# Altium project MU_MP_39_V1.PrjPcb (part 5 of 5)

## Sheet 20 WiFi_BT.SchDoc
size 420 x 297 mm; Address1: Address1; Address2: Address2; Address3: Address3; Address4: Address4; DocumentNumber: АБВГ.123456.001 Э3; SheetNumber: 20; SheetTotal: 23; Scale: 1:1; DocumentType: Схема электрическая принципиальная; FirstReferrence: АБВГ.123456.001
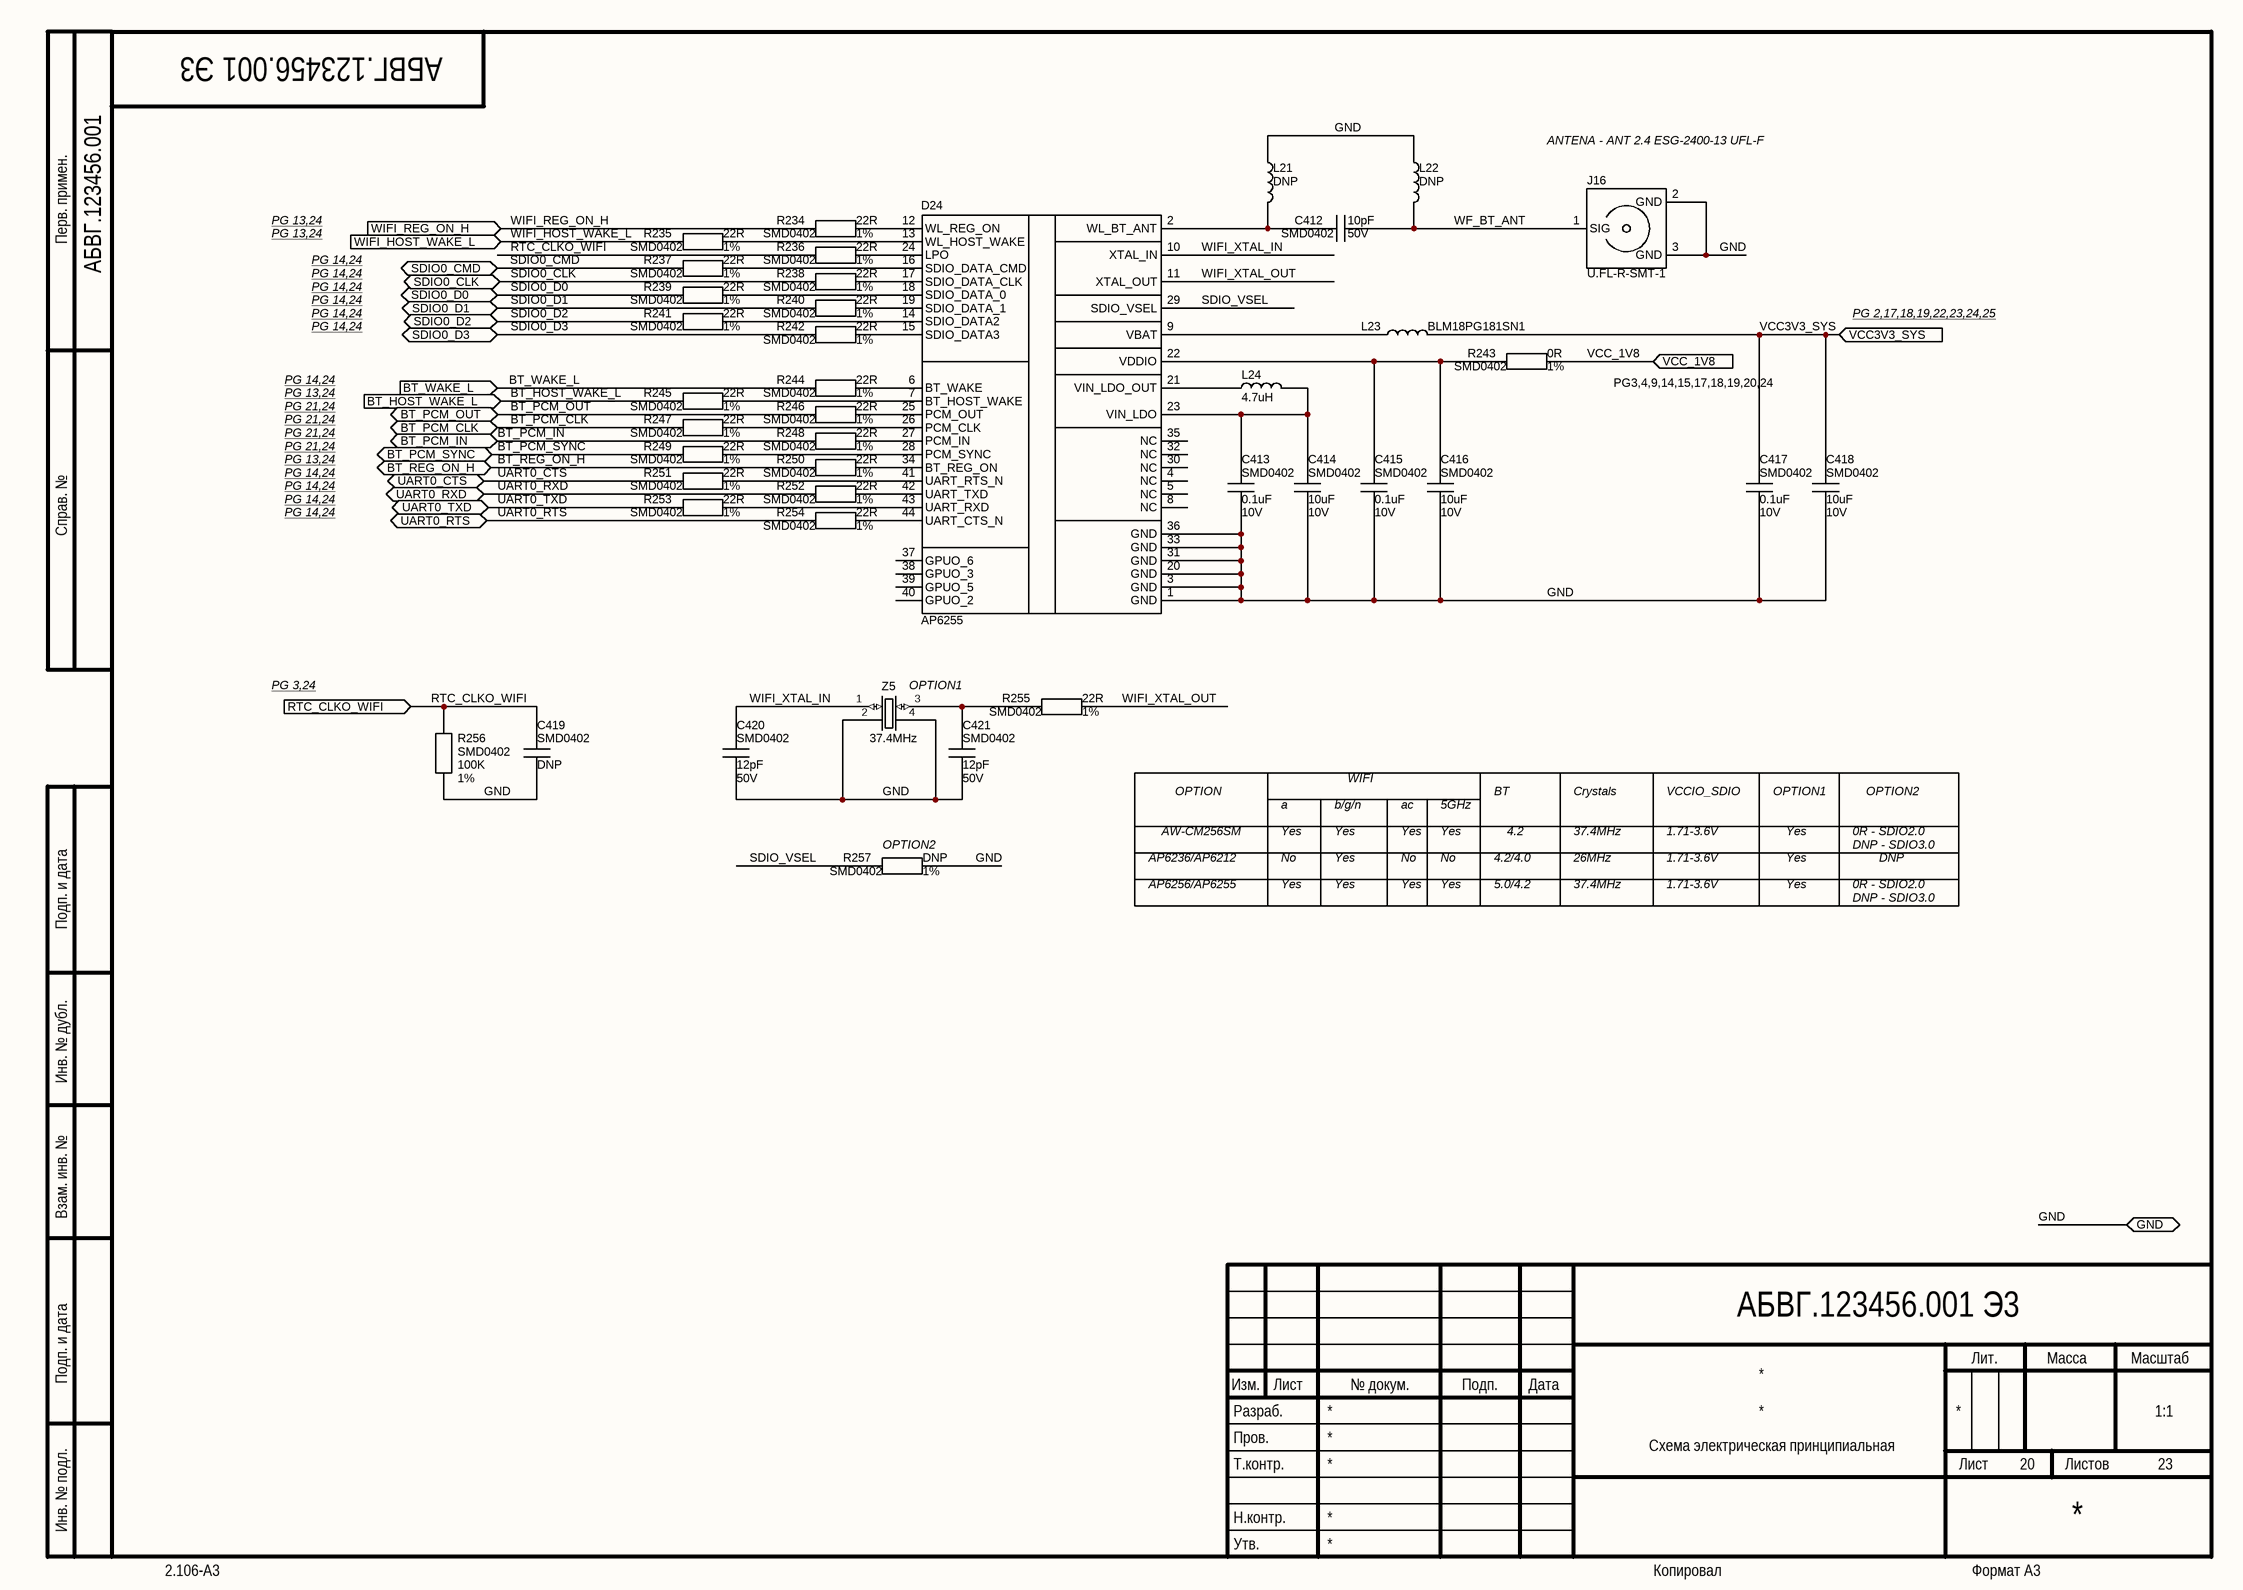
[diagram p19: 20 WiFi_BT.SchDoc]

### Parts
C412  Package: SMD0402  Voltage: 50V  [CAP_SMD_0402]  (hidden comment: 10pF)
C413  Package: SMD0402  Voltage: 10V  [CAP_SMD_0402]  (hidden comment: 0.1uF)
C414  Package: SMD0402  Voltage: 10V  [CAP_SMD_0402]  (hidden comment: 10uF)
C415  Package: SMD0402  Voltage: 10V  [CAP_SMD_0402]  (hidden comment: 0.1uF)
C416  Package: SMD0402  Voltage: 10V  [CAP_SMD_0402]  (hidden comment: 10uF)
C417  Package: SMD0402  Voltage: 10V  [CAP_SMD_0402]  (hidden comment: 0.1uF)
C418  Package: SMD0402  Voltage: 10V  [CAP_SMD_0402]  (hidden comment: 10uF)
C419  Package: SMD0402  [CAP_SMD_0402]  (hidden comment: DNP)
C420  Package: SMD0402  Voltage: 50V  [CAP_SMD_0402]  (hidden comment: 12pF)
C421  Package: SMD0402  Voltage: 50V  [CAP_SMD_0402]  (hidden comment: 12pF)
D24  AP6255  [AP6255]
J16  U.FL-R-SMT-1  [U.FL-R-SMT-1]
L21  value DNP  [IND_SMD_0402]  (hidden comment: Value)
L22  value DNP  [IND_SMD_0402]  (hidden comment: Value)
L23  value BLM18PG181SN1  [IND_SMD_0603]  (hidden comment: Value)
L24  value 4.7uH  [MWSA0402S]  (hidden comment: Value)
R234  Package: SMD0402  Tolerance: 1%  [RES_SMD_0402]  (hidden comment: 22R)
R235  Package: SMD0402  Tolerance: 1%  [RES_SMD_0402]  (hidden comment: 22R)
R236  Package: SMD0402  Tolerance: 1%  [RES_SMD_0402]  (hidden comment: 22R)
R237  Package: SMD0402  Tolerance: 1%  [RES_SMD_0402]  (hidden comment: 22R)
R238  Package: SMD0402  Tolerance: 1%  [RES_SMD_0402]  (hidden comment: 22R)
R239  Package: SMD0402  Tolerance: 1%  [RES_SMD_0402]  (hidden comment: 22R)
R240  Package: SMD0402  Tolerance: 1%  [RES_SMD_0402]  (hidden comment: 22R)
R241  Package: SMD0402  Tolerance: 1%  [RES_SMD_0402]  (hidden comment: 22R)
R242  Package: SMD0402  Tolerance: 1%  [RES_SMD_0402]  (hidden comment: 22R)
R243  Package: SMD0402  Tolerance: 1%  [RES_SMD_0402]  (hidden comment: 0R)
R244  Package: SMD0402  Tolerance: 1%  [RES_SMD_0402]  (hidden comment: 22R)
R245  Package: SMD0402  Tolerance: 1%  [RES_SMD_0402]  (hidden comment: 22R)
R246  Package: SMD0402  Tolerance: 1%  [RES_SMD_0402]  (hidden comment: 22R)
R247  Package: SMD0402  Tolerance: 1%  [RES_SMD_0402]  (hidden comment: 22R)
R248  Package: SMD0402  Tolerance: 1%  [RES_SMD_0402]  (hidden comment: 22R)
R249  Package: SMD0402  Tolerance: 1%  [RES_SMD_0402]  (hidden comment: 22R)
R250  Package: SMD0402  Tolerance: 1%  [RES_SMD_0402]  (hidden comment: 22R)
R251  Package: SMD0402  Tolerance: 1%  [RES_SMD_0402]  (hidden comment: 22R)
R252  Package: SMD0402  Tolerance: 1%  [RES_SMD_0402]  (hidden comment: 22R)
R253  Package: SMD0402  Tolerance: 1%  [RES_SMD_0402]  (hidden comment: 22R)
R254  Package: SMD0402  Tolerance: 1%  [RES_SMD_0402]  (hidden comment: 22R)
R255  Package: SMD0402  Tolerance: 1%  [RES_SMD_0402]  (hidden comment: 22R)
R256  Package: SMD0402  Tolerance: 1%  [RES_SMD_0402]  (hidden comment: 100K)
R257  Package: SMD0402  Tolerance: 1%  [RES_SMD_0402]  (hidden comment: DNP)
Z5  value 37.4MHz  [TSX3225]  (hidden comment: Value)

### Ports
BT_HOST_WAKE_L (in), BT_PCM_CLK (bidir), BT_PCM_IN (bidir), BT_PCM_OUT (bidir), BT_PCM_SYNC (bidir), BT_REG_ON_H (bidir), BT_WAKE_L (in), GND (bidir), RTC_CLKO_WIFI (in), SDIO0_CLK (bidir), SDIO0_CMD (bidir), SDIO0_D0 (bidir), SDIO0_D1 (bidir), SDIO0_D2 (bidir), SDIO0_D3 (bidir), UART0_CTS (bidir), UART0_RTS (bidir), UART0_RXD (bidir), UART0_TXD (bidir), VCC3V3_SYS (in), VCC_1V8 (in), WIFI_HOST_WAKE_L (in), WIFI_REG_ON_H (in)

### Nets
BT_HOST_WAKE_L: R245.1 ; port BT_HOST_WAKE_L
BT_PCM_CLK: R247.1 ; port BT_PCM_CLK
BT_PCM_IN: R248.1 ; port BT_PCM_IN
BT_PCM_OUT: R246.1 ; port BT_PCM_OUT
BT_PCM_SYNC: R249.1 ; port BT_PCM_SYNC
BT_REG_ON_H: R250.1 ; port BT_REG_ON_H
BT_WAKE_L: R244.1 ; port BT_WAKE_L
GND: C413.2 C414.2 C415.2 C416.2 C417.2 C418.2 C419.1 C420.2 C421.2 D24.1(GND) D24.3(GND) D24.20(GND) D24.31(GND) D24.33(GND) D24.36(GND) J16.2(GND) J16.3(GND) L21.2 L22.2 R256.1 R257.2 Z5.2(GND) Z5.4(GND) ; port GND
RTC_CLKO_WIFI: C419.2 R236.1 R256.2 ; port RTC_CLKO_WIFI
SDIO0_CLK: R238.1 ; port SDIO0_CLK
SDIO0_CMD: R237.1 ; port SDIO0_CMD
SDIO0_D0: R239.1 ; port SDIO0_D0
SDIO0_D1: R240.1 ; port SDIO0_D1
SDIO0_D2: R241.1 ; port SDIO0_D2
SDIO0_D3: R242.1 ; port SDIO0_D3
SDIO_VSEL: D24.29(SDIO_VSEL) R257.1
UART0_CTS: R251.1 ; port UART0_CTS
UART0_RTS: R254.1 ; port UART0_RTS
UART0_RXD: R252.1 ; port UART0_RXD
UART0_TXD: R253.1 ; port UART0_TXD
VCC3V3_SYS: C417.1 C418.1 L23.1 ; port VCC3V3_SYS
VCC_1V8: R243.2 ; port VCC_1V8
WF_BT_ANT: C412.2 J16.1(SIG) L22.1
WIFI_HOST_WAKE_L: R235.1 ; port WIFI_HOST_WAKE_L
WIFI_REG_ON_H: R234.1 ; port WIFI_REG_ON_H
WIFI_XTAL_IN: C420.1 D24.10(XTAL_IN) Z5.1(IN/OUT)
WIFI_XTAL_OUT: D24.11(XTAL_OUT) R255.2
NetC412_1: C412.1 D24.2(WL_BT_ANT) L21.1
NetC413_1: C413.1 C414.1 D24.23(VIN_LDO) L24.1
NetC415_1: C415.1 C416.1 D24.22(VDDIO) R243.1
NetC421_1: C421.1 R255.1 Z5.3(IN/OUT)
NetD24_6: D24.6(BT_WAKE) R244.2
NetD24_7: D24.7(BT_HOST_WAKE) R245.2
NetD24_9: D24.9(VBAT) L23.2
NetD24_12: D24.12(WL_REG_ON) R234.2
NetD24_13: D24.13(WL_HOST_WAKE) R235.2
NetD24_14: D24.14(SDIO_DATA2) R241.2
NetD24_15: D24.15(SDIO_DATA3) R242.2
NetD24_16: D24.16(SDIO_DATA_CMD) R237.2
NetD24_17: D24.17(SDIO_DATA_CLK) R238.2
NetD24_18: D24.18(SDIO_DATA_0) R239.2
NetD24_19: D24.19(SDIO_DATA_1) R240.2
NetD24_21: D24.21(VIN_LDO_OUT) L24.2
NetD24_24: D24.24(LPO) R236.2
NetD24_25: D24.25(PCM_OUT) R246.2
NetD24_26: D24.26(PCM_CLK) R247.2
NetD24_27: D24.27(PCM_IN) R248.2
NetD24_28: D24.28(PCM_SYNC) R249.2
NetD24_34: D24.34(BT_REG_ON) R250.2
NetD24_41: D24.41(UART_RTS_N) R251.2
NetD24_42: D24.42(UART_TXD) R252.2
NetD24_43: D24.43(UART_RXD) R253.2
NetD24_44: D24.44(UART_CTS_N) R254.2

Not connected (* = marked no-connect by the designer): D24 4(NC) 5(NC) 8(NC) 30(NC) 32(NC) 35(NC) 37(GPUO_6) 38(GPUO_3) 39(GPUO_5) 40(GPUO_2)

### Notes on the sheet
- (near J16) ANTENA - ANT 2.4 ESG-2400-13 UFL-F
- Перв. примен.
- PG 13,24
- PG 14,24
- PG 2,17,18,19,22,23,24,25
- PG 21,24
- PG3,4,9,14,15,17,18,19,20,24
- Справ. №
- PG 3,24
- (near Z5) OPTION1
- OPTION
- WIFI
- BT
- Crystals
- VCCIO_SDIO
- OPTION1
- OPTION2
- (near R257) OPTION2
- AP6236/AP6212
- AW-CM256SM
- a
- Yes
- No
- b/g/n
- ac
- 5GHz
- 4.2/4.0
- 4.2
- 37.4MHz
- 26MHz
- 1.71-3.6V
- 0R - SDIO2.0
- DNP - SDIO3.0
- DNP
- Подп. и дата
- AP6256/AP6255
- 5.0/4.2
- Инв. № дубл.
- Взам. инв. №
- Разраб.
- Изм.
- Лист
- № докум.
- Подп.
- Дата
- Лит.
- Масса
- Масштаб
- Пров.
- Т.контр.
- Листов
- Инв. № подл.
- Утв.
- Н.контр.
- 2.106-A3
- Копировал
- Формат А3

### Library data of the parts
C412 = Ceramic_Cap: PartNumber: CC0402CRNPO9BN100; ComponentType: SMD Ceramic Chip Capacitor; Manufacter: *; Tolerance: *; ClassName: *; Value: 10pF
C413 C415 C417 = Ceramic_Cap: PartNumber: CC0402KRX5R6BB104; ComponentType: SMD Ceramic Chip Capacitor; Manufacter: *; Tolerance: *; ClassName: *; Value: 0.1uF
C414 C416 C418 = Ceramic_Cap: PartNumber: CC0402MRX5R6BB106; ComponentType: SMD Ceramic Chip Capacitor; Manufacter: *; Tolerance: *; ClassName: *; Value: 10uF
C419 = Ceramic_Cap: PartNumber: Do Not Place; ComponentType: SMD Ceramic Chip Capacitor; Manufacter: *; Tolerance: *; ClassName: *; Value: DNP; Voltage: *
C420 C421 = Ceramic_Cap: PartNumber: CC0402JRNPO9BN120; ComponentType: SMD Ceramic Chip Capacitor; Manufacter: *; Tolerance: *; ClassName: *; Value: 12pF
J16 = UFL_CON: ComponentType: SMD Chip Resistor; Manufacter: *; Voltage: *; ClassName: *; Tolerance: *; PartNumber: U.FL-R-SMT-1; Package: U.FL-R-SMT-1; Value: U.FL-R-SMT-1
L21 L22 = Inductor_smal: PartNumber: Do Not Place; ComponentType: *; Manufacter: *; Package: SMD0402; ClassName: Solder_Clearence
L23 = Inductor_smal: ComponentType: *; Manufacter: *; Package: SMD0603; PartNumber: BLM18PG181SN1; ClassName: *
L24 = Inductor_smal: PartNumber: MWSA0402S-4R7MT; ComponentType: *; Manufacter: *; Package: MWSA0402S; ClassName: *
R234-R242 R244-R255 = Chip_Res: PartNumber: RC0402FR-0722RL; ComponentType: SMD Chip Resistor; Manufacter: *; Voltage: *; ClassName: *; Value: 22R
R243 = Chip_Res: PartNumber: RC0402FR-070RL; ComponentType: SMD Chip Resistor; Manufacter: *; Voltage: *; ClassName: *; Value: 0R
R256 = Chip_Res: PartNumber: RC0402FR-07100KL; ComponentType: SMD Chip Resistor; Manufacter: *; Voltage: *; ClassName: *; Value: 100K
R257 = Chip_Res: PartNumber: Do Not Place; ComponentType: SMD Chip Resistor; Manufacter: *; Voltage: *; ClassName: *; Value: DNP
Z5 = OSC3225: PartNumber: X3225374MOB4SI; ComponentType: *; Manufacter: *; Package: TSX3225
D24 = AP6255: ComponentType: SMD Chip Resistor; Manufacter: *; Voltage: *; ClassName: *; Tolerance: *; PartNumber: AP6255; Package: AP6255; Value: AP6255

## Sheet 21 CAN.SchDoc
size 420 x 297 mm; Address1: Address1; Address2: Address2; Address3: Address3; Address4: Address4; DocumentNumber: АБВГ.123456.001 Э3; SheetNumber: 21; SheetTotal: 23; Scale: 1:1; DocumentType: Схема электрическая принципиальная; FirstReferrence: АБВГ.123456.001
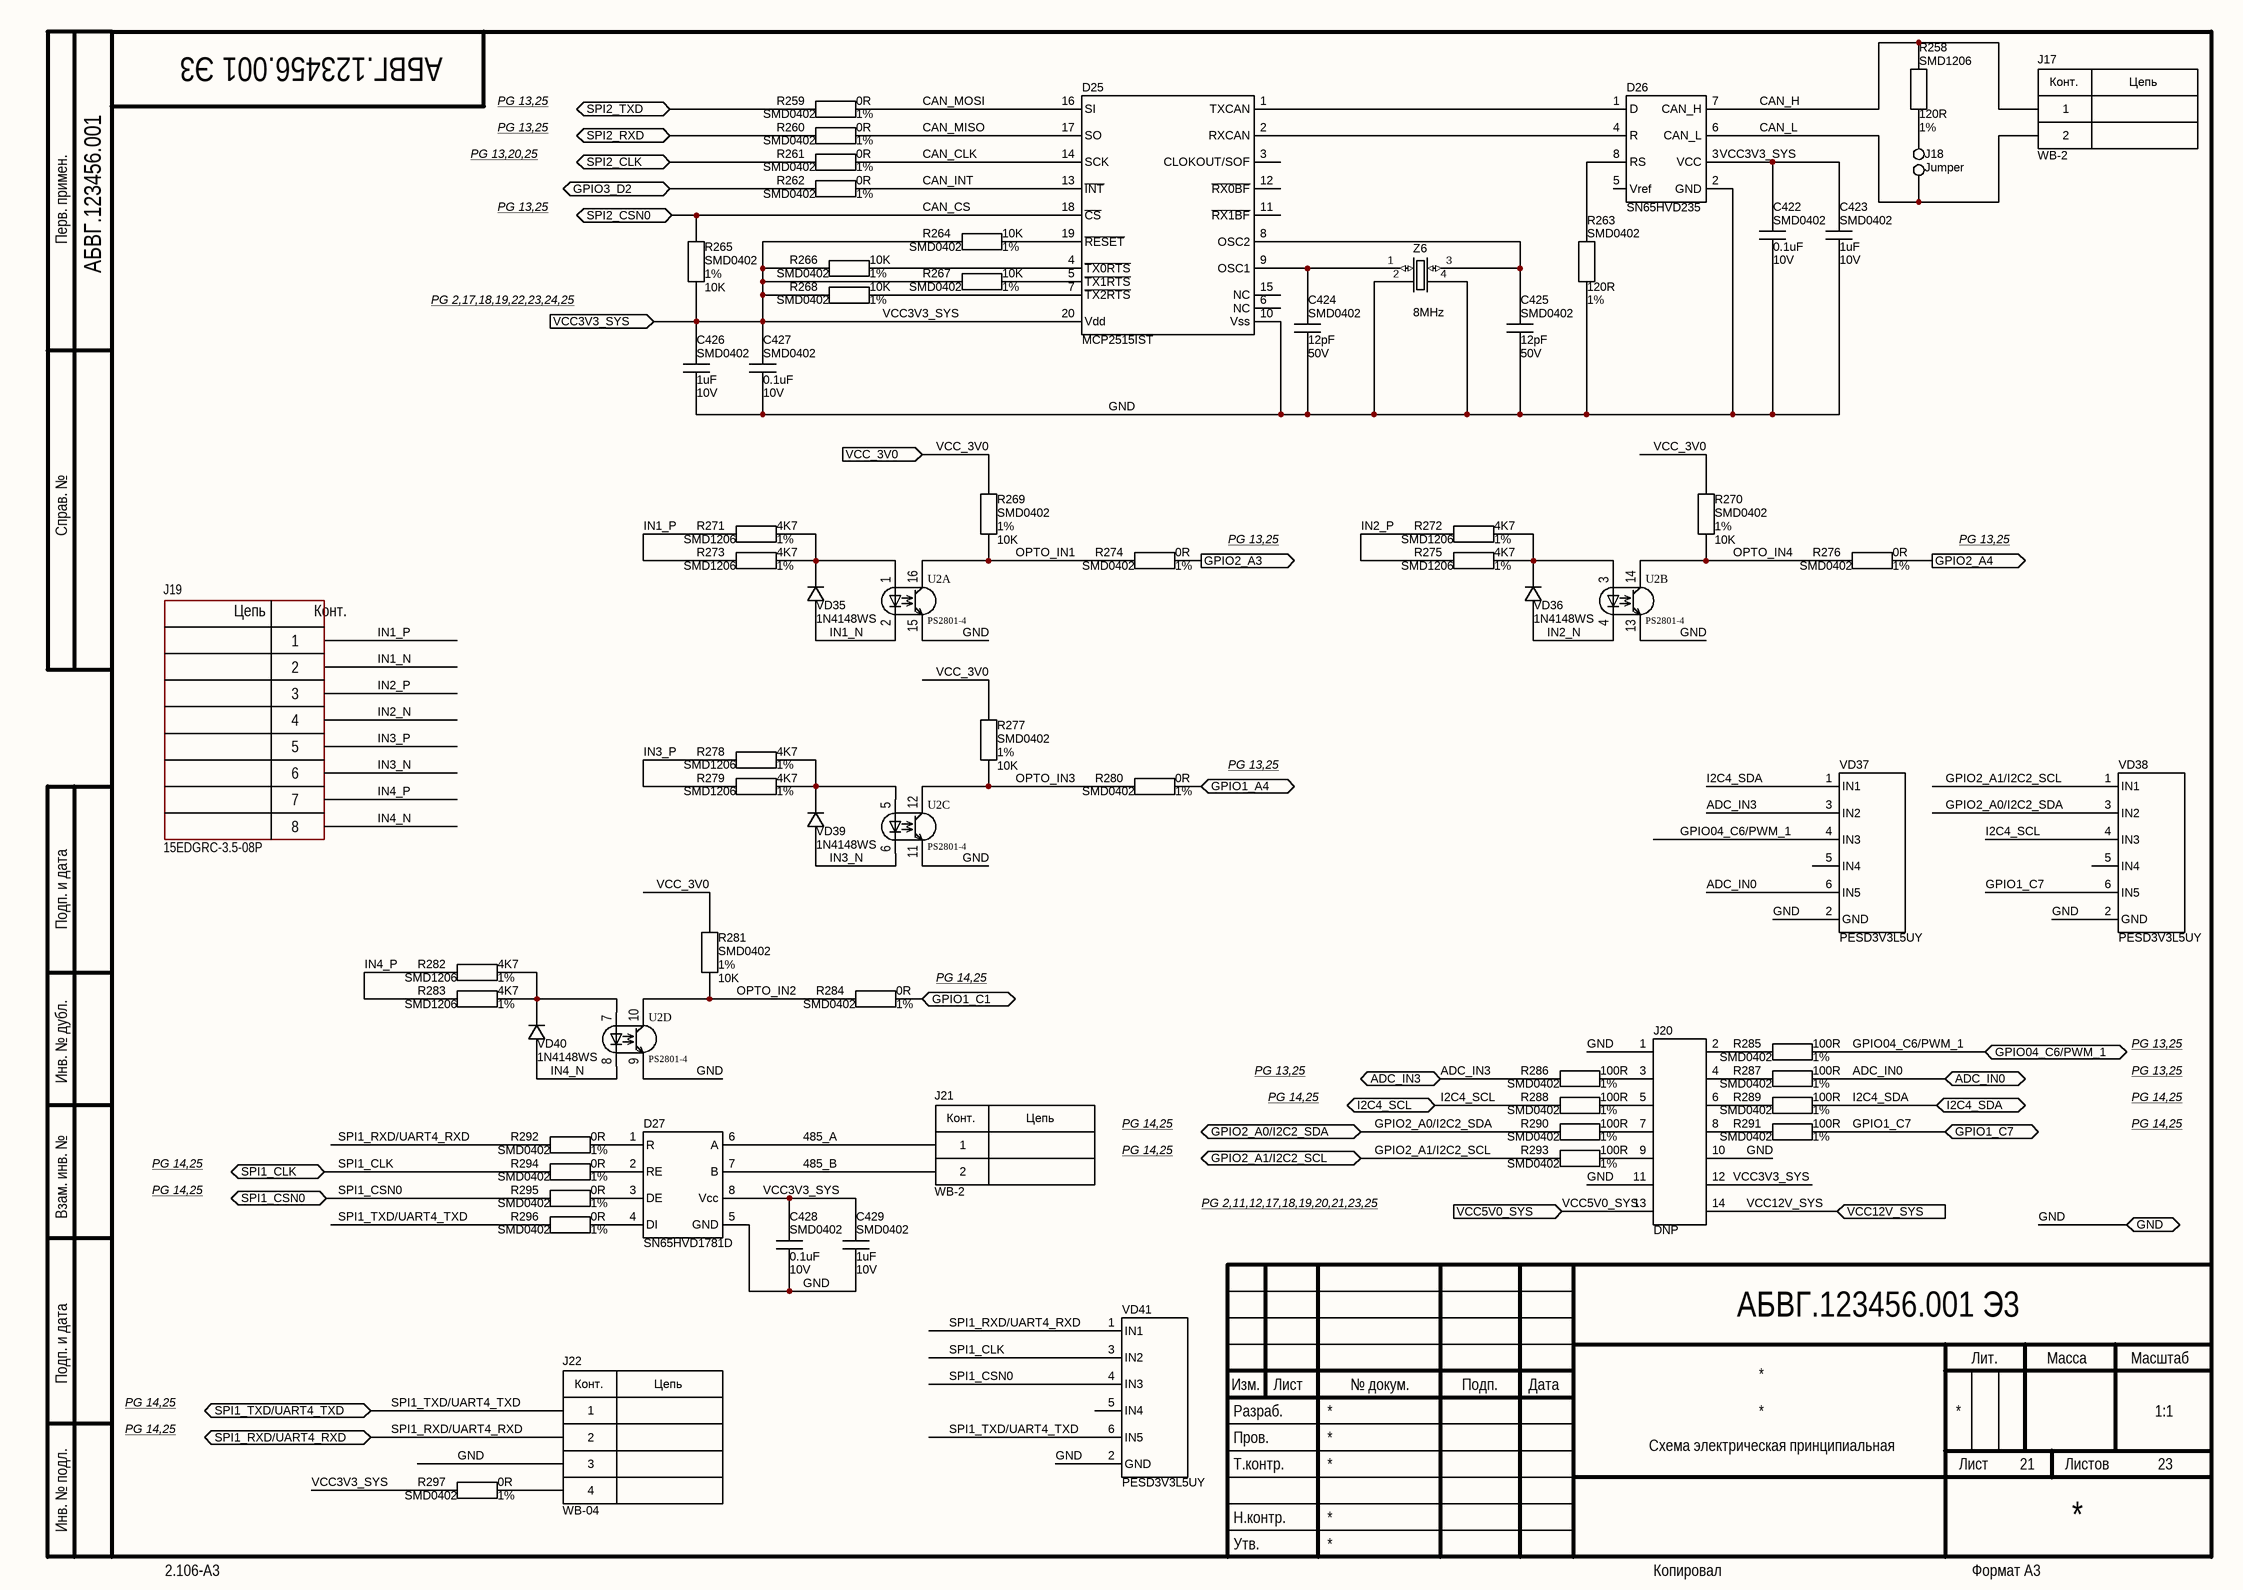
[diagram p20: 21 CAN.SchDoc]

### Parts
C422  Package: SMD0402  Voltage: 10V  [CAP_SMD_0402]  (hidden comment: 0.1uF)
C423  Package: SMD0402  Voltage: 10V  [CAP_SMD_0402]  (hidden comment: 1uF)
C424  Package: SMD0402  Voltage: 50V  [CAP_SMD_0402]  (hidden comment: 12pF)
C425  Package: SMD0402  Voltage: 50V  [CAP_SMD_0402]  (hidden comment: 12pF)
C426  Package: SMD0402  Voltage: 10V  [CAP_SMD_0402]  (hidden comment: 1uF)
C427  Package: SMD0402  Voltage: 10V  [CAP_SMD_0402]  (hidden comment: 0.1uF)
C428  Package: SMD0402  Voltage: 10V  [CAP_SMD_0402]  (hidden comment: 0.1uF)
C429  Package: SMD0402  Voltage: 10V  [CAP_SMD_0402]  (hidden comment: 1uF)
D25  MCP2515IST  [TSSOP-20]
D26  SN65HVD235  [SO8]
D27  SN65HVD1781D  [SO8]
J17  WB-2  [15EDGRC-3.5-02P]
J18  Jumper  [Jumper2]
J19  15EDGRC-3.5-08P  [15EDGRC-3.5-08P]
J20  DNP  [PLD2-14 (2.00)]
J21  WB-2  [15EDGRC-3.5-02P]
J22  WB-04  [WB-4]
R258  Package: SMD1206  Tolerance: 1%  [RES_SMD_1206]  (hidden comment: 120R)
R259  Package: SMD0402  Tolerance: 1%  [RES_SMD_0402]  (hidden comment: 0R)
R260  Package: SMD0402  Tolerance: 1%  [RES_SMD_0402]  (hidden comment: 0R)
R261  Package: SMD0402  Tolerance: 1%  [RES_SMD_0402]  (hidden comment: 0R)
R262  Package: SMD0402  Tolerance: 1%  [RES_SMD_0402]  (hidden comment: 0R)
R263  Package: SMD0402  Tolerance: 1%  [RES_SMD_0402]  (hidden comment: 120R)
R264  Package: SMD0402  Tolerance: 1%  [RES_SMD_0402]  (hidden comment: 10K)
R265  Package: SMD0402  Tolerance: 1%  [RES_SMD_0402]  (hidden comment: 10K)
R266  Package: SMD0402  Tolerance: 1%  [RES_SMD_0402]  (hidden comment: 10K)
R267  Package: SMD0402  Tolerance: 1%  [RES_SMD_0402]  (hidden comment: 10K)
R268  Package: SMD0402  Tolerance: 1%  [RES_SMD_0402]  (hidden comment: 10K)
R269  Package: SMD0402  Tolerance: 1%  [RES_SMD_0402]  (hidden comment: 10K)
R270  Package: SMD0402  Tolerance: 1%  [RES_SMD_0402]  (hidden comment: 10K)
R271  Package: SMD1206  Tolerance: 1%  [RES_SMD_1206]  (hidden comment: 4K7)
R272  Package: SMD1206  Tolerance: 1%  [RES_SMD_1206]  (hidden comment: 4K7)
R273  Package: SMD1206  Tolerance: 1%  [RES_SMD_1206]  (hidden comment: 4K7)
R274  Package: SMD0402  Tolerance: 1%  [RES_SMD_0402]  (hidden comment: 0R)
R275  Package: SMD1206  Tolerance: 1%  [RES_SMD_1206]  (hidden comment: 4K7)
R276  Package: SMD0402  Tolerance: 1%  [RES_SMD_0402]  (hidden comment: 0R)
R277  Package: SMD0402  Tolerance: 1%  [RES_SMD_0402]  (hidden comment: 10K)
R278  Package: SMD1206  Tolerance: 1%  [RES_SMD_1206]  (hidden comment: 4K7)
R279  Package: SMD1206  Tolerance: 1%  [RES_SMD_1206]  (hidden comment: 4K7)
R280  Package: SMD0402  Tolerance: 1%  [RES_SMD_0402]  (hidden comment: 0R)
R281  Package: SMD0402  Tolerance: 1%  [RES_SMD_0402]  (hidden comment: 10K)
R282  Package: SMD1206  Tolerance: 1%  [RES_SMD_1206]  (hidden comment: 4K7)
R283  Package: SMD1206  Tolerance: 1%  [RES_SMD_1206]  (hidden comment: 4K7)
R284  Package: SMD0402  Tolerance: 1%  [RES_SMD_0402]  (hidden comment: 0R)
R285  Package: SMD0402  Tolerance: 1%  [RES_SMD_0402]  (hidden comment: 100R)
R286  Package: SMD0402  Tolerance: 1%  [RES_SMD_0402]  (hidden comment: 100R)
R287  Package: SMD0402  Tolerance: 1%  [RES_SMD_0402]  (hidden comment: 100R)
R288  Package: SMD0402  Tolerance: 1%  [RES_SMD_0402]  (hidden comment: 100R)
R289  Package: SMD0402  Tolerance: 1%  [RES_SMD_0402]  (hidden comment: 100R)
R290  Package: SMD0402  Tolerance: 1%  [RES_SMD_0402]  (hidden comment: 100R)
R291  Package: SMD0402  Tolerance: 1%  [RES_SMD_0402]  (hidden comment: 100R)
R292  Package: SMD0402  Tolerance: 1%  [RES_SMD_0402]  (hidden comment: 0R)
R293  Package: SMD0402  Tolerance: 1%  [RES_SMD_0402]  (hidden comment: 100R)
R294  Package: SMD0402  Tolerance: 1%  [RES_SMD_0402]  (hidden comment: 0R)
R295  Package: SMD0402  Tolerance: 1%  [RES_SMD_0402]  (hidden comment: 0R)
R296  Package: SMD0402  Tolerance: 1%  [RES_SMD_0402]  (hidden comment: 0R)
R297  Package: SMD0402  Tolerance: 1%  [RES_SMD_0402]  (hidden comment: 0R)
U2  PS2801-4  [SOIC127P700X210-16N]  (parts A,B,C,D of 4)
VD35  value 1N4148WS  [SOD323]  (hidden comment: Diode)
VD36  value 1N4148WS  [SOD323]  (hidden comment: Diode)
VD37  PESD3V3L5UY  [SC70-6]
VD38  PESD3V3L5UY  [SC70-6]
VD39  value 1N4148WS  [SOD323]  (hidden comment: Diode)
VD40  value 1N4148WS  [SOD323]  (hidden comment: Diode)
VD41  PESD3V3L5UY  [SC70-6]
Z6  value 8MHz  [TSX3225]  (hidden comment: Value)

### Ports
ADC_IN0 (bidir), ADC_IN3 (bidir), GND (bidir), GPIO1_A4 (bidir), GPIO1_C1 (bidir), GPIO1_C7 (bidir), GPIO2_A0/I2C2_SDA (bidir), GPIO2_A1/I2C2_SCL (bidir), GPIO2_A3 (out), GPIO2_A4 (out), GPIO3_D2 (bidir), GPIO04_C6/PWM_1 (bidir), I2C4_SCL (bidir), I2C4_SDA (bidir), SPI1_CLK (bidir), SPI1_CSN0 (bidir), SPI1_RXD/UART4_RXD (bidir), SPI1_TXD/UART4_TXD (bidir), SPI2_CLK (bidir), SPI2_CSN0 (bidir), SPI2_RXD (bidir), SPI2_TXD (bidir), VCC3V3_SYS (in), VCC5V0_SYS (in), VCC12V_SYS (in), VCC_3V0 (in)

### Nets
485_A: D27.6(A) J21.1
485_B: D27.7(B) J21.2
ADC_IN0: R287.2 VD37.6(IN5) ; port ADC_IN0
ADC_IN3: R286.1 VD37.3(IN2) ; port ADC_IN3
CAN_CLK: D25.14(SCK) R261.2
CAN_CS: D25.18(~{CS}) R265.2 ; port SPI2_CSN0
CAN_H: D26.7(CAN_H) J17.1 R258.1
CAN_INT: D25.13(~{INT}) R262.2
CAN_L: D26.6(CAN_L) J17.2 J18.1
CAN_MISO: D25.17(SO) R260.2
CAN_MOSI: D25.16(SI) R259.2
GND: C422.2 C423.2 C424.2 C425.2 C426.2 C427.2 C428.2 C429.2 D25.10(Vss) D26.2(GND) D27.5(GND) J20.1 J20.10 J20.11 J22.3 R263.2 U2.9(E) U2.11(E) U2.13(E) U2.15(E) VD37.2(GND) VD38.2(GND) VD41.2(GND) Z6.2(GND) Z6.4(GND) ; port GND
GPIO1_A4: R280.2 ; port GPIO1_A4
GPIO1_C1: R284.2 ; port GPIO1_C1
GPIO1_C7: R291.2 VD38.6(IN5) ; port GPIO1_C7
GPIO2_A0/I2C2_SDA: R290.1 VD38.3(IN2) ; port GPIO2_A0/I2C2_SDA
GPIO2_A1/I2C2_SCL: R293.1 VD38.1(IN1) ; port GPIO2_A1/I2C2_SCL
GPIO2_A3: R274.2 ; port GPIO2_A3
GPIO2_A4: R276.2 ; port GPIO2_A4
GPIO3_D2: R262.1 ; port GPIO3_D2
GPIO04_C6/PWM_1: R285.2 VD37.4(IN3) ; port GPIO04_C6/PWM_1
I2C4_SCL: R288.1 VD38.4(IN3) ; port I2C4_SCL
I2C4_SDA: R289.2 VD37.1(IN1) ; port I2C4_SDA
IN1_N: J19.2 U2.2(C) VD35.1(A)
IN1_P: J19.1 R271.2 R273.2
IN2_N: J19.4 U2.4(C) VD36.1(A)
IN2_P: J19.3 R272.2 R275.2
IN3_N: J19.6 U2.6(C) VD39.1(A)
IN3_P: J19.5 R278.2 R279.2
IN4_N: J19.8 U2.8(C) VD40.1(A)
IN4_P: J19.7 R282.2 R283.2
OPTO_IN1: R269.1 R274.1 U2.16(C)
OPTO_IN2: R281.1 R284.1 U2.10(C)
OPTO_IN3: R277.1 R280.1 U2.12(C)
OPTO_IN4: R270.1 R276.1 U2.14(C)
SPI1_CLK: R294.1 VD41.3(IN2) ; port SPI1_CLK
SPI1_CSN0: R295.1 VD41.4(IN3) ; port SPI1_CSN0
SPI1_RXD/UART4_RXD: J22.2 R292.1 VD41.1(IN1) ; port SPI1_RXD/UART4_RXD
SPI1_TXD/UART4_TXD: J22.1 R296.1 VD41.6(IN5) ; port SPI1_TXD/UART4_TXD
SPI2_CLK: R261.1 ; port SPI2_CLK
SPI2_RXD: R260.1 ; port SPI2_RXD
SPI2_TXD: R259.1 ; port SPI2_TXD
VCC3V3_SYS: C422.1 C423.1 C426.1 C427.1 C428.1 C429.1 D25.20(Vdd) D26.3(VCC) D27.8(Vcc) J20.12 R264.2 R265.1 R266.2 R267.2 R268.2 R297.1 ; port VCC3V3_SYS
VCC5V0_SYS: J20.13 ; port VCC5V0_SYS
VCC12V_SYS: J20.14 ; port VCC12V_SYS
VCC_3V0: R269.2 R270.2 R277.2 R281.2 ; port VCC_3V0
NetC424_1: C424.1 D25.9(OSC1) Z6.1(IN/OUT)
NetC425_1: C425.1 D25.8(OSC2) Z6.3(IN/OUT)
NetD25_1: D25.1(TXCAN) D26.1(D)
NetD25_2: D25.2(RXCAN) D26.4(R)
NetD25_4: D25.4(~{TX0RTS}) R266.1
NetD25_5: D25.5(~{TX1RTS}) R267.1
NetD25_7: D25.7(~{TX2RTS}) R268.1
NetD25_19: D25.19(~{RESET}) R264.1
NetD26_8: D26.8(RS) R263.1
NetD27_1: D27.1(R) R292.2
NetD27_2: D27.2(RE) R294.2
NetD27_3: D27.3(DE) R295.2
NetD27_4: D27.4(DI) R296.2
NetJ18_2: J18.2 R258.2
NetJ20_2: J20.2 R285.1
NetJ20_3: J20.3 R286.2
NetJ20_4: J20.4 R287.1
NetJ20_5: J20.5 R288.2
NetJ20_6: J20.6 R289.1
NetJ20_7: J20.7 R290.2
NetJ20_8: J20.8 R291.1
NetJ20_9: J20.9 R293.2
NetJ22_4: J22.4 R297.2
NetR271_1: R271.1 R273.1 U2.1(A) VD35.2(C)
NetR272_1: R272.1 R275.1 U2.3(A) VD36.2(C)
NetR278_1: R278.1 R279.1 U2.5(A) VD39.2(C)
NetR282_1: R282.1 R283.1 U2.7(A) VD40.2(C)

Not connected (* = marked no-connect by the designer): D25 3(CLOKOUT/SOF) 6(NC) 11(~{RX1BF}) 12(~{RX0BF}) 15(NC); D26 5(Vref); VD37 5(IN4); VD38 5(IN4); VD41 5(IN4)

### Notes on the sheet
- PG 13,25
- PG 13,20,25
- Перв. примен.
- PG 2,17,18,19,22,23,24,25
- Справ. №
- Подп. и дата
- (near R284) PG 14,25
- Инв. № дубл.
- PG 14,25
- PG 2,11,12,17,18,19,20,21,23,25
- Взам. инв. №
- Разраб.
- Изм.
- Лист
- № докум.
- Подп.
- Дата
- Лит.
- Масса
- Масштаб
- Пров.
- Т.контр.
- Листов
- Инв. № подл.
- Утв.
- Н.контр.
- 2.106-A3
- Копировал
- Формат А3
- (in symbol CON2) Конт.; Цепь
- (in symbol CON4) Конт.; Цепь
- (in symbol CON8) Цепь; Конт.

### Library data of the parts
C422 C427 C428 = Ceramic_Cap: PartNumber: CC0402KRX5R6BB104; ComponentType: SMD Ceramic Chip Capacitor; Manufacter: *; Tolerance: *; ClassName: *; Value: 0.1uF
C423 C426 C429 = Ceramic_Cap: PartNumber: CC0402KRX5R6BB105; ComponentType: SMD Ceramic Chip Capacitor; Manufacter: *; Tolerance: *; ClassName: *; Value: 1uF
C424 C425 = Ceramic_Cap: PartNumber: CC0402JRNPO9BN120; ComponentType: SMD Ceramic Chip Capacitor; Manufacter: *; Tolerance: *; ClassName: *; Value: 12pF
D26 = SN65HVD230D: Manufacter: TI; PartNumber: SN65HVD235D; ComponentType: CAN Bus Transceiver; Package: SO8; Value: SN65HVD235
D27 = SN65HVD1781D: Manufacter: TI; ComponentType: RS-485 Transceiver; Package: SO8; PartNumber: SN65HVD1781D; Value: SN65HVD1781D
J17 J21 = CON2: PartNumber: DS1066-02M(MW-2M); ComponentType: *; Manufacter: *; Package: WB-2; ClassName: *; Value: WB-2
J18 = Jumper: PartNumber: DS1025-01-1x2P8BV1-B; ComponentType: *; Manufacter: *; Package: PLS-2(2.00); ClassName: *; Value: Jumper
J19 = CON8: Manufacter: *; Package: 15EDGRC-3.5-08P; PartNumber: 15EDGRC-3.5-08P; ClassName: *; Value: 15EDGRC-3.5-08P
J20 = CON14_2: PartNumber: PLD2-14 (2.00; ComponentType: *; Manufacter: *; Package: PLD2-14 (2.00; ClassName: *; Value: DNP
J22 = CON4: PartNumber: DS1066-04M; Manufacter: *; Package: WB-04; ClassName: *; Value: WB-04
R258 = Chip_Res: PartNumber: RC1206FR-07120RL; ComponentType: SMD Chip Resistor; Manufacter: *; Voltage: *; ClassName: *; Value: 120R
R259-R262 R274 R276 R280 R284 R292 R294-R297 = Chip_Res: PartNumber: RC0402FR-070RL; ComponentType: SMD Chip Resistor; Manufacter: *; Voltage: *; ClassName: *; Value: 0R
R263 = Chip_Res: PartNumber: RC0402FR-07120RL; ComponentType: SMD Chip Resistor; Manufacter: *; Voltage: *; ClassName: *; Value: 120R
R264-R270 R277 R281 = Chip_Res: PartNumber: RC0402FR-0710KL; ComponentType: SMD Chip Resistor; Manufacter: *; Voltage: *; ClassName: *; Value: 10K
R271-R273 R275 R278 R279 R282 R283 = Chip_Res: PartNumber: RC1206FR-074K7L; ComponentType: SMD Chip Resistor; Manufacter: *; Voltage: *; ClassName: *; Value: 4K7
R285-R291 R293 = Chip_Res: PartNumber: RC0402FR-07100RL; ComponentType: SMD Chip Resistor; Manufacter: *; Voltage: *; ClassName: *; Value: 100R
U2 = PS2801-4-F3-A: Optocoupler X4; Manufacturer: Renesas; Comments: 80V, 50mA; PartNumber: PS2801-4-F3-A; Value: PS2801-4; Package: SOIC127P700X210-16N; ClassName: *
Z6 = OSC3225: PartNumber: X32258MOB4SI; ComponentType: *; Manufacter: *; Package: TSX3225
D25 = MCP2515IST: ComponentType: SMD Chip Resistor; Manufacter: *; Voltage: *; ClassName: *; Tolerance: *; PartNumber: MCP2515IST; Package: TSSOP-20; Value: MCP2515IST
VD35 VD36 VD39 VD40 = Diode: ComponentType: *; Manufacter: *; Package: SOD323; PartNumber: 1N4148WS; ClassName: *
VD37 VD38 VD41 = PESD3V3L5UY: ComponentType: *; Manufacter: *; Package: SC70-6; PartNumber: PESD3V3L5UY; ClassName: *; Value: PESD3V3L5UY

## Sheet 22 PCIE.SchDoc
size 420 x 297 mm; Address1: Address1; Address2: Address2; Address3: Address3; Address4: Address4; DocumentNumber: АБВГ.123456.001 Э3; SheetNumber: 22; SheetTotal: 23; Scale: 1:1; DocumentType: Схема электрическая принципиальная; FirstReferrence: АБВГ.123456.001
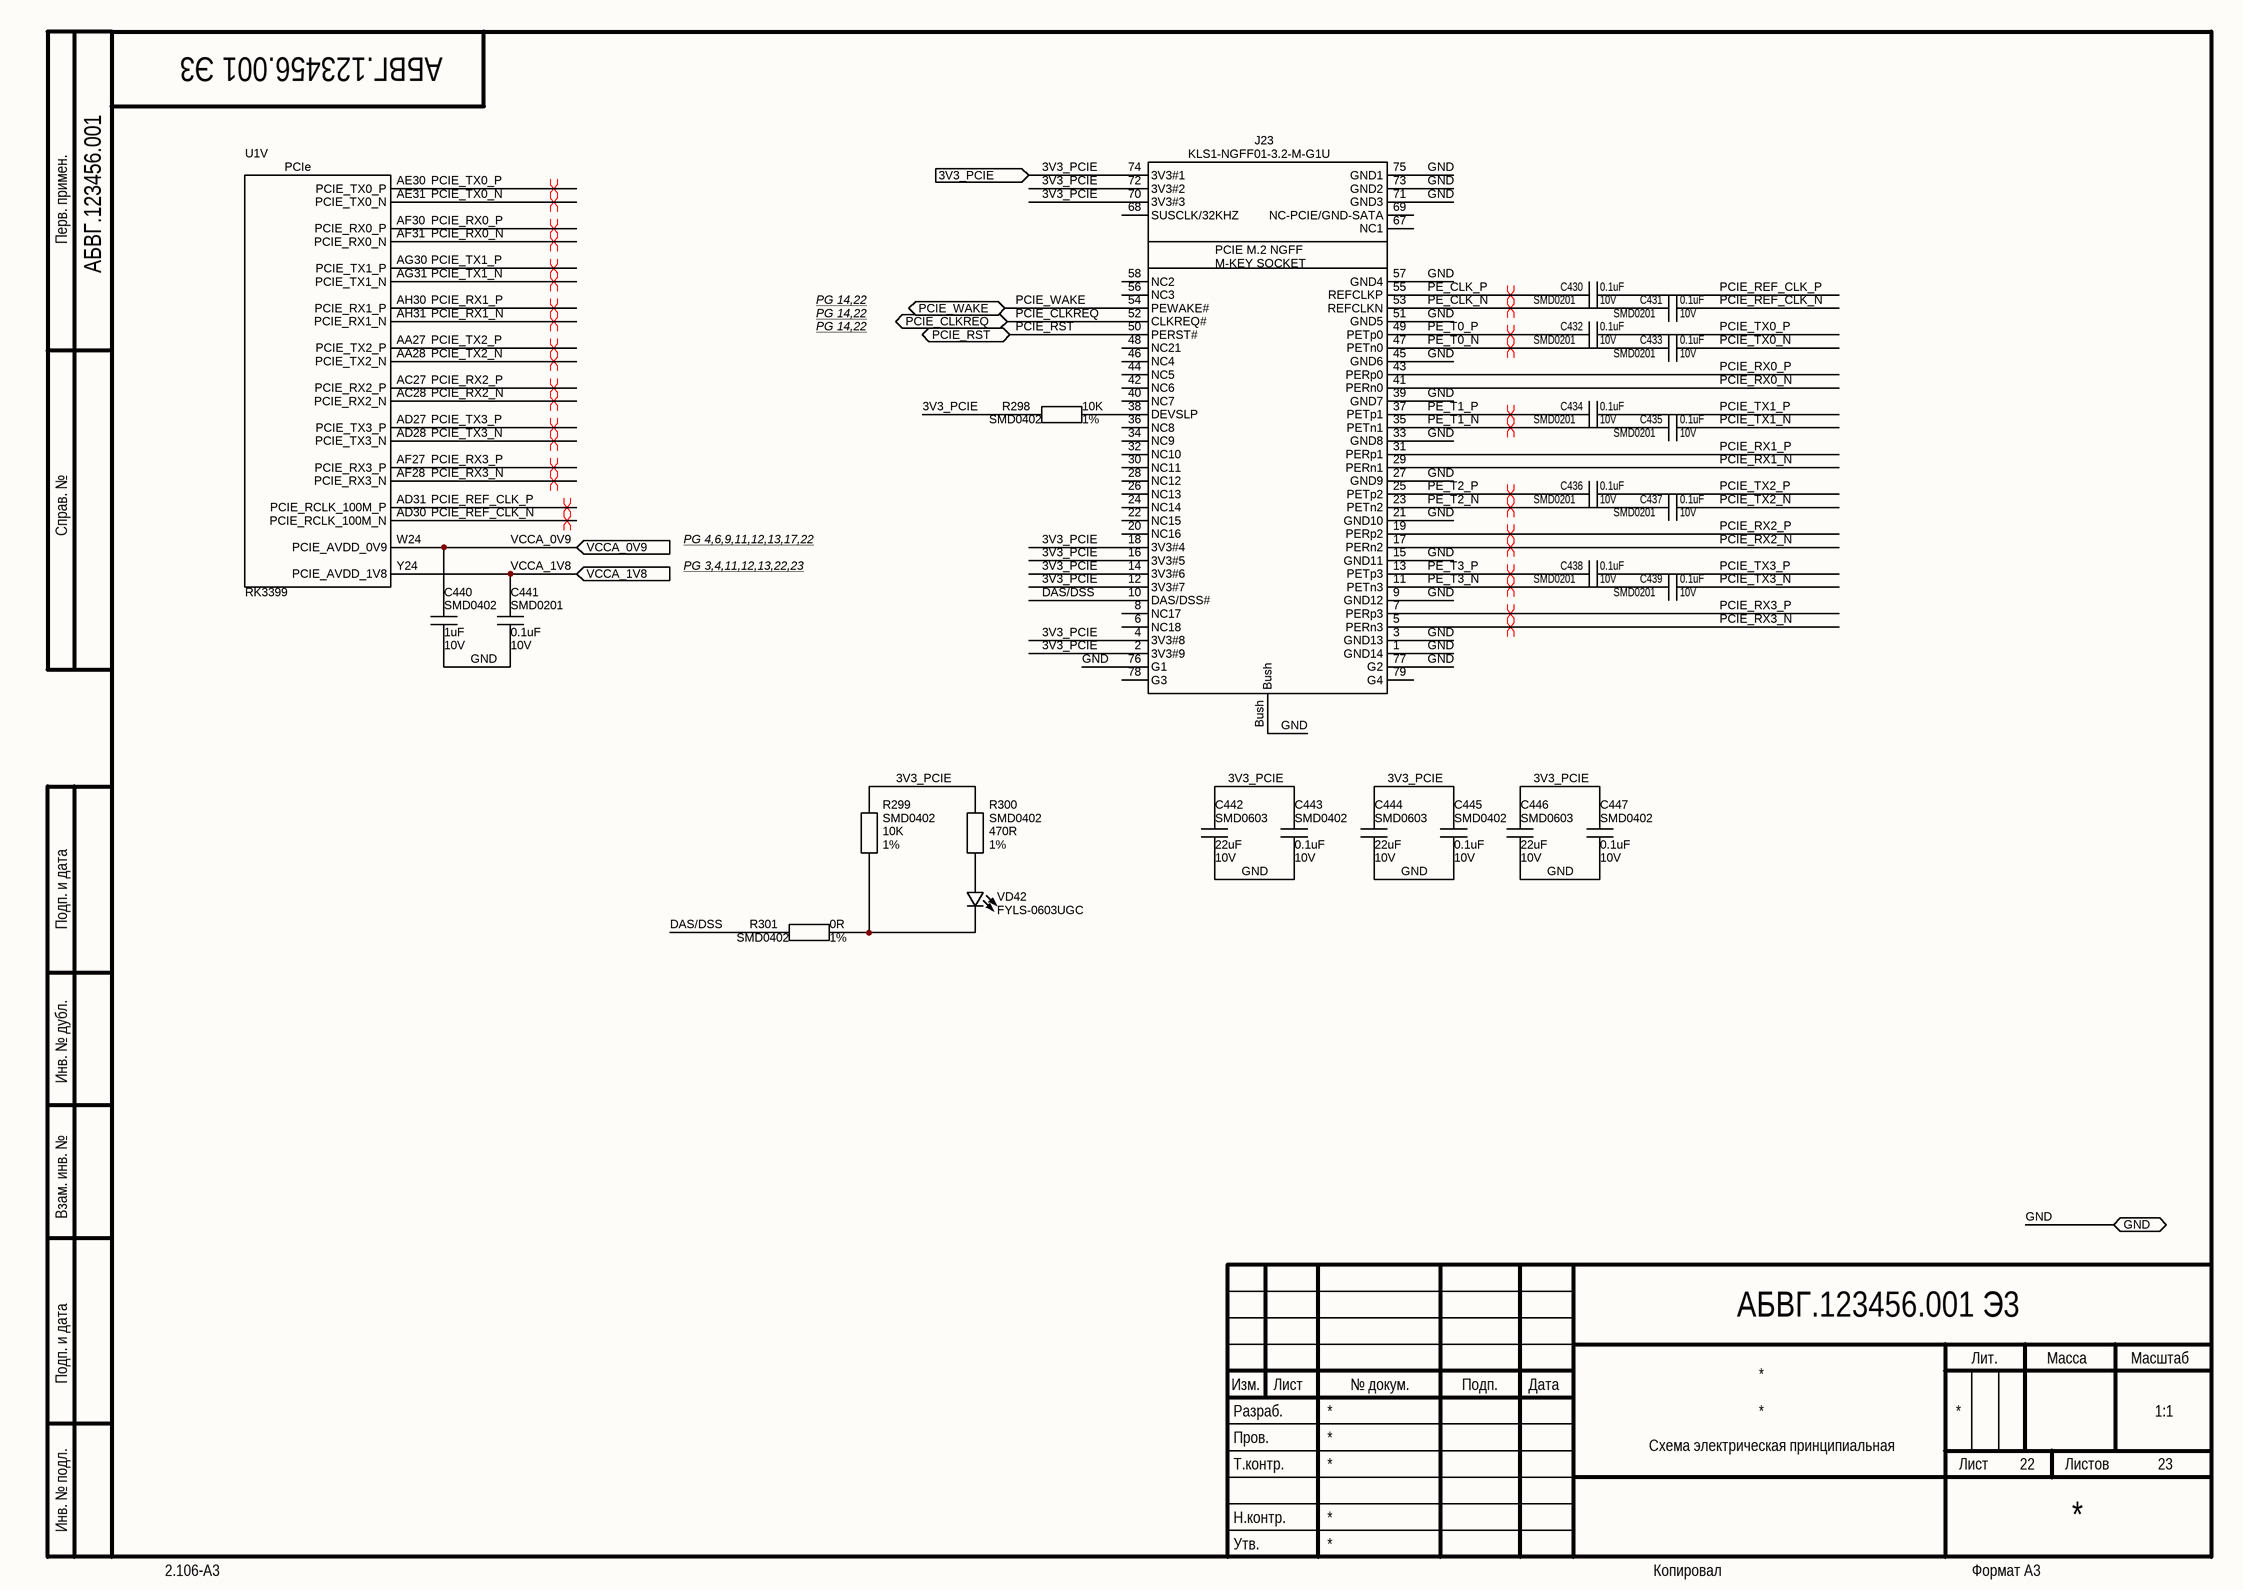
[diagram p21: 22 PCIE.SchDoc]

### Parts
C430  Package: SMD0201  Voltage: 10V  [CAP_SMD_0201]  (hidden comment: 0.1uF)
C431  Package: SMD0201  Voltage: 10V  [CAP_SMD_0201]  (hidden comment: 0.1uF)
C432  Package: SMD0201  Voltage: 10V  [CAP_SMD_0201]  (hidden comment: 0.1uF)
C433  Package: SMD0201  Voltage: 10V  [CAP_SMD_0201]  (hidden comment: 0.1uF)
C434  Package: SMD0201  Voltage: 10V  [CAP_SMD_0201]  (hidden comment: 0.1uF)
C435  Package: SMD0201  Voltage: 10V  [CAP_SMD_0201]  (hidden comment: 0.1uF)
C436  Package: SMD0201  Voltage: 10V  [CAP_SMD_0201]  (hidden comment: 0.1uF)
C437  Package: SMD0201  Voltage: 10V  [CAP_SMD_0201]  (hidden comment: 0.1uF)
C438  Package: SMD0201  Voltage: 10V  [CAP_SMD_0201]  (hidden comment: 0.1uF)
C439  Package: SMD0201  Voltage: 10V  [CAP_SMD_0201]  (hidden comment: 0.1uF)
C440  Package: SMD0402  Voltage: 10V  [CAP_SMD_0402_small]  (hidden comment: 1uF)
C441  Package: SMD0201  Voltage: 10V  [CAP_SMD_0201]  (hidden comment: 0.1uF)
C442  Package: SMD0603  Voltage: 10V  [CAP_SMD_0603]  (hidden comment: 22uF)
C443  Package: SMD0402  Voltage: 10V  [CAP_SMD_0402]  (hidden comment: 0.1uF)
C444  Package: SMD0603  Voltage: 10V  [CAP_SMD_0603]  (hidden comment: 22uF)
C445  Package: SMD0402  Voltage: 10V  [CAP_SMD_0402]  (hidden comment: 0.1uF)
C446  Package: SMD0603  Voltage: 10V  [CAP_SMD_0603]  (hidden comment: 22uF)
C447  Package: SMD0402  Voltage: 10V  [CAP_SMD_0402]  (hidden comment: 0.1uF)
J23  KLS1-NGFF01-3.2-M-G1U  [KLS1-NGFF01-3.2-M-G1U_42mm]
R298  Package: SMD0402  Tolerance: 1%  [RES_SMD_0402]  (hidden comment: 10K)
R299  Package: SMD0402  Tolerance: 1%  [RES_SMD_0402]  (hidden comment: 10K)
R300  Package: SMD0402  Tolerance: 1%  [RES_SMD_0402]  (hidden comment: 470R)
R301  Package: SMD0402  Tolerance: 1%  [RES_SMD_0402]  (hidden comment: 0R)
U1  value RK3399  [BGA828C65P31X31_2100X2100X161N]  (hidden comment: RK3399_FF)  (part V of 23)
VD42  FYLS-0603UGC  [LED_0603]

### Ports
3V3_PCIE (in), GND (bidir), PCIE_CLKREQ (bidir), PCIE_RST (bidir), PCIE_WAKE (bidir), VCCA_0V9 (in), VCCA_1V8 (in)

### Nets
3V3_PCIE: C442.2 C443.1 C444.2 C445.1 C446.2 C447.1 J23.2(3V3#9) J23.4(3V3#8) J23.12(3V3#7) J23.14(3V3#6) J23.16(3V3#5) J23.18(3V3#4) J23.70(3V3#3) J23.72(3V3#2) J23.74(3V3#1) R298.2 R299.2 R300.2 ; port 3V3_PCIE
DAS/DSS: J23.10(DAS/DSS#) R301.2
GND: C440.2 C441.2 C442.1 C443.2 C444.1 C445.2 C446.1 C447.2 J23.1(GND14) J23.3(GND13) J23.9(GND12) J23.15(GND11) J23.21(GND10) J23.27(GND9) J23.33(GND8) J23.39(GND7) J23.45(GND6) J23.51(GND5) J23.57(GND4) J23.71(GND3) J23.73(GND2) J23.75(GND1) J23.76(G1) J23.77(G2) J23.Bush ; port GND
PCIE_CLKREQ: J23.52(CLKREQ#) ; port PCIE_CLKREQ
PCIE_REF_CLK_N: C431.1 U1.AD30(PCIE_RCLK_100M_N)
PCIE_REF_CLK_P: C430.1 U1.AD31(PCIE_RCLK_100M_P)
PCIE_RST: J23.50(PERST#) ; port PCIE_RST
PCIE_RX0_N: J23.41(PERn0) U1.AF31(PCIE_RX0_N)
PCIE_RX0_P: J23.43(PERp0) U1.AF30(PCIE_RX0_P)
PCIE_RX1_N: J23.29(PERn1) U1.AH31(PCIE_RX1_N)
PCIE_RX1_P: J23.31(PERp1) U1.AH30(PCIE_RX1_P)
PCIE_RX2_N: J23.17(PERn2) U1.AC28(PCIE_RX2_N)
PCIE_RX2_P: J23.19(PERp2) U1.AC27(PCIE_RX2_P)
PCIE_RX3_N: J23.5(PERn3) U1.AF28(PCIE_RX3_N)
PCIE_RX3_P: J23.7(PERp3) U1.AF27(PCIE_RX3_P)
PCIE_TX0_N: C433.1 U1.AE31(PCIE_TX0_N)
PCIE_TX0_P: C432.1 U1.AE30(PCIE_TX0_P)
PCIE_TX1_N: C435.1 U1.AG31(PCIE_TX1_N)
PCIE_TX1_P: C434.1 U1.AG30(PCIE_TX1_P)
PCIE_TX2_N: C437.1 U1.AA28(PCIE_TX2_N)
PCIE_TX2_P: C436.1 U1.AA27(PCIE_TX2_P)
PCIE_TX3_N: C439.1 U1.AD28(PCIE_TX3_N)
PCIE_TX3_P: C438.1 U1.AD27(PCIE_TX3_P)
PCIE_WAKE: J23.54(PEWAKE#) ; port PCIE_WAKE
PE_CLK_N: C431.2 J23.53(REFCLKN)
PE_CLK_P: C430.2 J23.55(REFCLKP)
PE_T0_N: C433.2 J23.47(PETn0)
PE_T0_P: C432.2 J23.49(PETp0)
PE_T1_N: C435.2 J23.35(PETn1)
PE_T1_P: C434.2 J23.37(PETp1)
PE_T2_N: C437.2 J23.23(PETn2)
PE_T2_P: C436.2 J23.25(PETp2)
PE_T3_N: C439.2 J23.11(PETn3)
PE_T3_P: C438.2 J23.13(PETp3)
VCCA_0V9: C440.1 U1.W24(PCIE_AVDD_0V9) ; port VCCA_0V9
VCCA_1V8: C441.1 U1.Y24(PCIE_AVDD_1V8) ; port VCCA_1V8
NetJ23_38: J23.38(DEVSLP) R298.1
NetR299_1: R299.1 R301.1 VD42.2(C)
NetR300_1: R300.1 VD42.1(A)

Not connected (* = marked no-connect by the designer): J23 6(NC18) 8(NC17) 20(NC16) 22(NC15) 24(NC14) 26(NC13) 28(NC12) 30(NC11) 32(NC10) 34(NC9) 36(NC8) 40(NC7) 42(NC6) 44(NC5) 46(NC4) 48(NC21) 56(NC3) 58(NC2) 67(NC1) 68(SUSCLK/32KHZ) 69(NC-PCIE/GND-SATA) 78(G3) 79(G4)

### Layout directives
differential pair; differential pair class DiffPair_1; net class DiffPair_1: PCIE_REF_CLK_N, PCIE_REF_CLK_P, PCIE_RX0_N, PCIE_RX0_P, PCIE_RX1_N, PCIE_RX1_P, PCIE_RX2_N, PCIE_RX2_P, PCIE_RX3_N, PCIE_RX3_P, PCIE_TX0_N, PCIE_TX0_P, PCIE_TX1_N, PCIE_TX1_P, PCIE_TX2_N, PCIE_TX2_P, PCIE_TX3_N, PCIE_TX3_P, PE_CLK_N, PE_CLK_P, PE_T0_N, PE_T0_P, PE_T1_N, PE_T1_P, PE_T2_N, PE_T2_P, PE_T3_N, PE_T3_P

### Notes on the sheet
- Перв. примен.
- PG 14,22
- Справ. №
- PG 3,4,11,12,13,22,23
- PG 4,6,9,11,12,13,17,22
- Подп. и дата
- Инв. № дубл.
- Взам. инв. №
- Разраб.
- Изм.
- Лист
- № докум.
- Подп.
- Дата
- Лит.
- Масса
- Масштаб
- Пров.
- Т.контр.
- Листов
- Инв. № подл.
- Утв.
- Н.контр.
- 2.106-A3
- Копировал
- Формат А3
- (in symbol KLS1-NGFF01-3.2-M-G1U_1) PCIE M.2 NGFF / M-KEY SOCKET
- (in symbol RK3399_FF, part V) PCIe

### Library data of the parts
C430-C439 C441 = Ceramic_Cap: PartNumber: CC0201KRX5R6BB104; ComponentType: SMD Ceramic Chip Capacitor; Manufacter: *; Tolerance: *; ClassName: *; Value: 0.1uF
C440 = Ceramic_Cap: PartNumber: CC0402KRX5R6BB105; ComponentType: SMD Ceramic Chip Capacitor; Manufacter: *; Tolerance: *; ClassName: Solder_Clearence; Value: 1uF
C442 C444 C446 = Ceramic_Cap: PartNumber: CL10A226MP8NUNE; ComponentType: SMD Ceramic Chip Capacitor; Manufacter: *; Tolerance: *; ClassName: *; Value: 22uF
C443 C445 C447 = Ceramic_Cap: PartNumber: CC0402KRX5R6BB104; ComponentType: SMD Ceramic Chip Capacitor; Manufacter: *; Tolerance: *; ClassName: *; Value: 0.1uF
J23 = KLS1-NGFF01-3.2-M-G1U_1: ComponentType: SMD Chip Resistor; Manufacter: *; Voltage: *; ClassName: *; Tolerance: *; PartNumber: KLS1-NGFF01-3.2-M-G1U; Package: KLS1-NGFF01-3.2-M-G1U; Value: KLS1-NGFF01-3.2-M-G1U
R298 R299 = Chip_Res: PartNumber: RC0402FR-0710KL; ComponentType: SMD Chip Resistor; Manufacter: *; Voltage: *; ClassName: *; Value: 10K
R300 = Chip_Res: PartNumber: RC0402FR-07470RL; ComponentType: SMD Chip Resistor; Manufacter: *; Voltage: *; ClassName: *; Value: 470R
R301 = Chip_Res: PartNumber: RC0402FR-070RL; ComponentType: SMD Chip Resistor; Manufacter: *; Voltage: *; ClassName: *; Value: 0R
VD42 = LED: ComponentType: *; Manufacter: *; Package: SMD0603; PartNumber: FYLS-0603UGC; Value: FYLS-0603UGC
U1 = RK3399_FF: Package: BGA828; ComponentType: *; Manufacter: *; PartNumber: RK3399; ClassName: *

## Sheet 23 Unused.SchDoc
size 420 x 297 mm; Address1: Address1; Address2: Address2; Address3: Address3; Address4: Address4; DocumentNumber: АБВГ.123456.001 Э3; SheetNumber: 23; SheetTotal: 23; Scale: 1:1; DocumentType: Схема электрическая принципиальная; FirstReferrence: АБВГ.123456.001
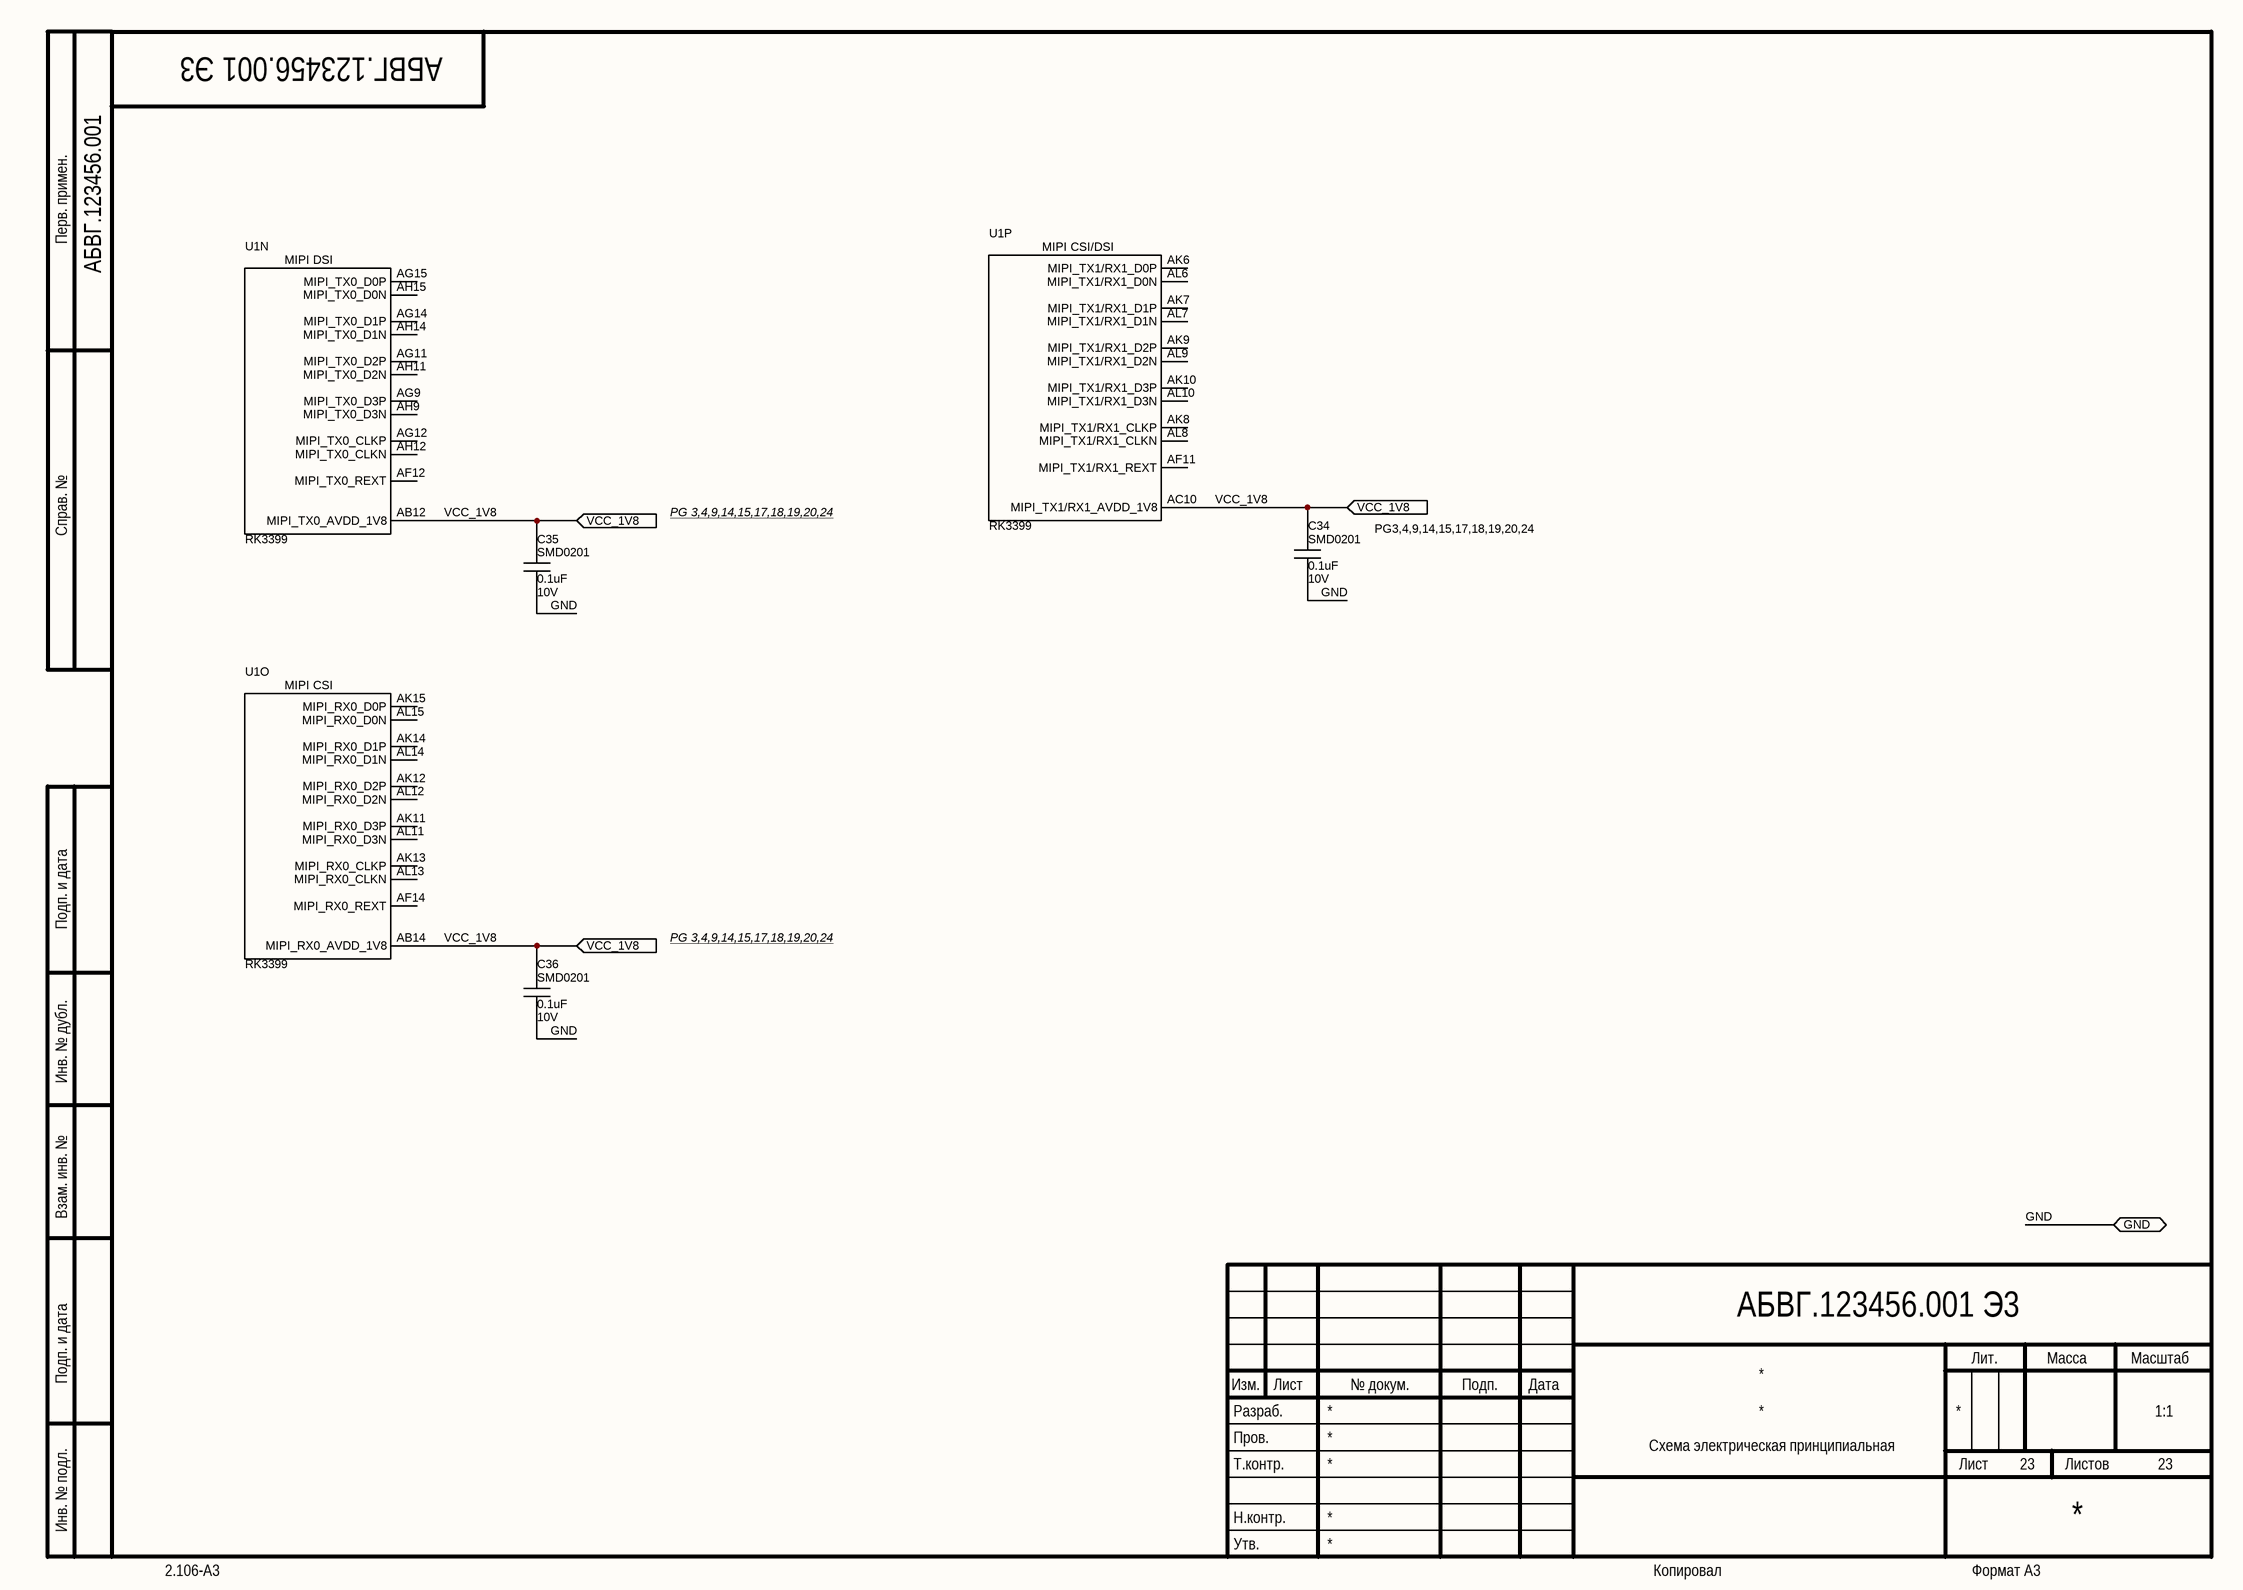
[diagram p22: 23 Unused.SchDoc]

### Parts
C34  Package: SMD0201  Voltage: 10V  [CAP_SMD_0201]  (hidden comment: 0.1uF)
C35  Package: SMD0201  Voltage: 10V  [CAP_SMD_0201]  (hidden comment: 0.1uF)
C36  Package: SMD0201  Voltage: 10V  [CAP_SMD_0201]  (hidden comment: 0.1uF)
U1  value RK3399  [BGA828C65P31X31_2100X2100X161N]  (hidden comment: RK3399_FF)  (parts N,O,P of 23)

### Ports
GND (bidir), VCC_1V8 (in)

### Nets
GND: C34.2 C35.2 C36.2 ; port GND
VCC_1V8: C34.1 C35.1 C36.1 U1.AB12(MIPI_TX0_AVDD_1V8) U1.AB14(MIPI_RX0_AVDD_1V8) U1.AC10(MIPI_TX1/RX1_AVDD_1V8) ; port VCC_1V8

Not connected (* = marked no-connect by the designer): U1 AF11(MIPI_TX1/RX1_REXT) AF12(MIPI_TX0_REXT) AF14(MIPI_RX0_REXT) AG9(MIPI_TX0_D3P) AG11(MIPI_TX0_D2P) AG12(MIPI_TX0_CLKP) AG14(MIPI_TX0_D1P) AG15(MIPI_TX0_D0P) AH9(MIPI_TX0_D3N) AH11(MIPI_TX0_D2N) AH12(MIPI_TX0_CLKN) AH14(MIPI_TX0_D1N) AH15(MIPI_TX0_D0N) AK6(MIPI_TX1/RX1_D0P) AK7(MIPI_TX1/RX1_D1P) AK8(MIPI_TX1/RX1_CLKP) AK9(MIPI_TX1/RX1_D2P) AK10(MIPI_TX1/RX1_D3P) AK11(MIPI_RX0_D3P) AK12(MIPI_RX0_D2P) AK13(MIPI_RX0_CLKP) AK14(MIPI_RX0_D1P) AK15(MIPI_RX0_D0P) AL6(MIPI_TX1/RX1_D0N) AL7(MIPI_TX1/RX1_D1N) AL8(MIPI_TX1/RX1_CLKN) AL9(MIPI_TX1/RX1_D2N) AL10(MIPI_TX1/RX1_D3N) AL11(MIPI_RX0_D3N) AL12(MIPI_RX0_D2N) AL13(MIPI_RX0_CLKN) AL14(MIPI_RX0_D1N) AL15(MIPI_RX0_D0N)

### Notes on the sheet
- Перв. примен.
- Справ. №
- PG 3,4,9,14,15,17,18,19,20,24
- PG3,4,9,14,15,17,18,19,20,24
- Подп. и дата
- Инв. № дубл.
- Взам. инв. №
- Разраб.
- Изм.
- Лист
- № докум.
- Подп.
- Дата
- Лит.
- Масса
- Масштаб
- Пров.
- Т.контр.
- Листов
- Инв. № подл.
- Утв.
- Н.контр.
- 2.106-A3
- Копировал
- Формат А3
- (in symbol RK3399_FF, part N) MIPI DSI
- (in symbol RK3399_FF, part O) MIPI CSI
- (in symbol RK3399_FF, part P) MIPI CSI/DSI

### Library data of the parts
C34-C36 = Ceramic_Cap: PartNumber: CC0201KRX5R6BB104; ComponentType: SMD Ceramic Chip Capacitor; Manufacter: *; Tolerance: *; ClassName: *; Value: 0.1uF
U1 = RK3399_FF: Package: BGA828; ComponentType: *; Manufacter: *; PartNumber: RK3399; ClassName: *

## Nets that join several sheets
3V3_PCIE: 02 INPUT_PWR_2 (7 pins), 22 PCIE (18 pins)
ADC_IN0: 13 CPU_1 (U1.AG26), 21 CAN (R287.2 VD37.6)
ADC_IN3: 13 CPU_1 (U1.AG28), 21 CAN (R286.1 VD37.3)
BL_EN: 14 CPU_2 (U1.L26), 17 EDP (J10.27)
BT_HOST_WAKE_L: 13 CPU_1 (U1.AA25), 20 WiFi_BT (R245.1)
BT_PCM_CLK: 18 I2S (U1.AG3), 20 WiFi_BT (R247.1)
BT_PCM_IN: 18 I2S (U1.AH1), 20 WiFi_BT (R248.1)
BT_PCM_OUT: 18 I2S (U1.Y7), 20 WiFi_BT (R246.1)
BT_PCM_SYNC: 18 I2S (U1.AF4), 20 WiFi_BT (R249.1)
BT_REG_ON_H: 13 CPU_1 (R106.2 R107.1 U1.V30), 20 WiFi_BT (R250.1)
BT_WAKE_L: 14 CPU_2 (U1.AL4), 20 WiFi_BT (R244.1)
CAN_CS: 13 CPU_1 (U1.F31), 21 CAN (D25.18 R265.2)
CHG_CC0_INT_L: 12 USB_3 (D17.5), 14 CPU_2 (U1.R26)
CPU_B_SLEEP_H: 04 POWER (D6.A1 R39.2), 14 CPU_2 (U1.N31)
DDR0_A0: 06 CPU_RAM (U1.F2), 08 RAM (D11.R2)
DDR0_A1: 06 CPU_RAM (U1.F1), 08 RAM (D11.P2)
DDR0_A2: 06 CPU_RAM (U1.G1), 08 RAM (D11.N2)
DDR0_A3: 06 CPU_RAM (U1.G2), 08 RAM (D11.N3)
DDR0_A4: 06 CPU_RAM (U1.H2), 08 RAM (D11.M3)
DDR0_A5: 06 CPU_RAM (U1.H1), 08 RAM (D11.F3)
DDR0_A6: 06 CPU_RAM (U1.J1), 08 RAM (D11.E3)
DDR0_A7: 06 CPU_RAM (U1.J2), 08 RAM (D11.E2)
DDR0_A8: 06 CPU_RAM (U1.K2), 08 RAM (D11.D2)
DDR0_A9: 06 CPU_RAM (U1.K1), 08 RAM (D11.C2)
DDR0_CKE0: 06 CPU_RAM (U1.E1), 08 RAM (D11.K3)
DDR0_CKE1: 06 CPU_RAM (U1.F5), 08 RAM (D11.K4)
DDR0_CLK0_N: 06 CPU_RAM (U1.J4), 08 RAM (D11.J2 R73.2)
DDR0_CLK0_P: 06 CPU_RAM (U1.H4), 08 RAM (D11.J3 R71.2)
DDR0_CSN0: 06 CPU_RAM (U1.M6), 08 RAM (D11.L3)
DDR0_CSN1: 06 CPU_RAM (U1.B1), 08 RAM (D11.L4)
DDR0_D0: 06 CPU_RAM (U1.AB2), 08 RAM (D11.P9)
DDR0_D1: 06 CPU_RAM (U1.AB1), 08 RAM (D11.N9)
DDR0_D2: 06 CPU_RAM (U1.AA2), 08 RAM (D11.N10)
DDR0_D3: 06 CPU_RAM (U1.AA1), 08 RAM (D11.N11)
DDR0_D4: 06 CPU_RAM (U1.Y2), 08 RAM (D11.M8)
DDR0_D5: 06 CPU_RAM (U1.Y1), 08 RAM (D11.M9)
DDR0_D6: 06 CPU_RAM (U1.W1), 08 RAM (D11.M10)
DDR0_D7: 06 CPU_RAM (U1.W2), 08 RAM (D11.M11)
DDR0_D8: 06 CPU_RAM (U1.AF2), 08 RAM (D11.F11)
DDR0_D9: 06 CPU_RAM (U1.AE2), 08 RAM (D11.F10)
DDR0_D10: 06 CPU_RAM (U1.AF1), 08 RAM (D11.F9)
DDR0_D11: 06 CPU_RAM (U1.AD2), 08 RAM (D11.F8)
DDR0_D12: 06 CPU_RAM (U1.AE1), 08 RAM (D11.E11)
DDR0_D13: 06 CPU_RAM (U1.AD1), 08 RAM (D11.E10)
DDR0_D14: 06 CPU_RAM (U1.AC1), 08 RAM (D11.E9)
DDR0_D15: 06 CPU_RAM (U1.AC2), 08 RAM (D11.D9)
DDR0_D16: 06 CPU_RAM (U1.V1), 08 RAM (D11.T8)
DDR0_D17: 06 CPU_RAM (U1.V2), 08 RAM (D11.T9)
DDR0_D18: 06 CPU_RAM (U1.U1), 08 RAM (D11.T10)
DDR0_D19: 06 CPU_RAM (U1.U2), 08 RAM (D11.T11)
DDR0_D20: 06 CPU_RAM (U1.T1), 08 RAM (D11.R8)
DDR0_D21: 06 CPU_RAM (U1.T2), 08 RAM (D11.R9)
DDR0_D22: 06 CPU_RAM (U1.R2), 08 RAM (D11.R10)
DDR0_D23: 06 CPU_RAM (U1.R1), 08 RAM (D11.R11)
DDR0_D24: 06 CPU_RAM (U1.P1), 08 RAM (D11.C11)
DDR0_D25: 06 CPU_RAM (U1.P2), 08 RAM (D11.C10)
DDR0_D26: 06 CPU_RAM (U1.N1), 08 RAM (D11.C9)
DDR0_D27: 06 CPU_RAM (U1.M1), 08 RAM (D11.C8)
DDR0_D28: 06 CPU_RAM (U1.N2), 08 RAM (D11.B11)
DDR0_D29: 06 CPU_RAM (U1.L1), 08 RAM (D11.B10)
DDR0_D30: 06 CPU_RAM (U1.M2), 08 RAM (D11.B9)
DDR0_D31: 06 CPU_RAM (U1.L2), 08 RAM (D11.B8)
DDR0_DM0: 06 CPU_RAM (U1.Y5), 08 RAM (D11.L8)
DDR0_DM1: 06 CPU_RAM (U1.AC5), 08 RAM (D11.G8)
DDR0_DM2: 06 CPU_RAM (U1.U5), 08 RAM (D11.P8)
DDR0_DM3: 06 CPU_RAM (U1.P5), 08 RAM (D11.D8)
DDR0_DQS0_N: 06 CPU_RAM (U1.AA4), 08 RAM (D11.L11)
DDR0_DQS0_P: 06 CPU_RAM (U1.Y4), 08 RAM (D11.L10)
DDR0_DQS1_N: 06 CPU_RAM (U1.AD4), 08 RAM (D11.G11)
DDR0_DQS1_P: 06 CPU_RAM (U1.AC4), 08 RAM (D11.G10)
DDR0_DQS2_N: 06 CPU_RAM (U1.V4), 08 RAM (D11.P11)
DDR0_DQS2_P: 06 CPU_RAM (U1.U4), 08 RAM (D11.P10)
DDR0_DQS3_N: 06 CPU_RAM (U1.R4), 08 RAM (D11.D11)
DDR0_DQS3_P: 06 CPU_RAM (U1.P4), 08 RAM (D11.D10)
DDR0_ODT0: 06 CPU_RAM (U1.L4), 08 RAM (D11.J8)
DDR1_A0: 06 CPU_RAM (U1.B10), 08 RAM (D12.R2)
DDR1_A1: 06 CPU_RAM (U1.A10), 08 RAM (D12.P2)
DDR1_A2: 06 CPU_RAM (U1.B9), 08 RAM (D12.N2)
DDR1_A3: 06 CPU_RAM (U1.A9), 08 RAM (D12.N3)
DDR1_A4: 06 CPU_RAM (U1.B8), 08 RAM (D12.M3)
DDR1_A5: 06 CPU_RAM (U1.A8), 08 RAM (D12.F3)
DDR1_A6: 06 CPU_RAM (U1.B7), 08 RAM (D12.E3)
DDR1_A7: 06 CPU_RAM (U1.A7), 08 RAM (D12.E2)
DDR1_A8: 06 CPU_RAM (U1.B6), 08 RAM (D12.D2)
DDR1_A9: 06 CPU_RAM (U1.A6), 08 RAM (D12.C2)
DDR1_CKE0: 06 CPU_RAM (U1.A5), 08 RAM (D12.K3)
DDR1_CKE1: 06 CPU_RAM (U1.E6), 08 RAM (D12.K4)
DDR1_CLK0_N: 06 CPU_RAM (U1.D8), 08 RAM (D12.J2 R74.2)
DDR1_CLK0_P: 06 CPU_RAM (U1.D9), 08 RAM (D12.J3 R72.2)
DDR1_CSN0: 06 CPU_RAM (U1.F12), 08 RAM (D12.L3)
DDR1_CSN1: 06 CPU_RAM (U1.A2), 08 RAM (D12.L4)
DDR1_D0: 06 CPU_RAM (U1.B15), 08 RAM (D12.P9)
DDR1_D1: 06 CPU_RAM (U1.A15), 08 RAM (D12.N9)
DDR1_D2: 06 CPU_RAM (U1.B16), 08 RAM (D12.N10)
DDR1_D3: 06 CPU_RAM (U1.A16), 08 RAM (D12.N11)
DDR1_D4: 06 CPU_RAM (U1.B17), 08 RAM (D12.M8)
DDR1_D5: 06 CPU_RAM (U1.A17), 08 RAM (D12.M9)
DDR1_D6: 06 CPU_RAM (U1.A18), 08 RAM (D12.M10)
DDR1_D7: 06 CPU_RAM (U1.B18), 08 RAM (D12.M11)
DDR1_D8: 06 CPU_RAM (U1.B11), 08 RAM (D12.F11)
DDR1_D9: 06 CPU_RAM (U1.B12), 08 RAM (D12.F10)
DDR1_D10: 06 CPU_RAM (U1.A11), 08 RAM (D12.F9)
DDR1_D11: 06 CPU_RAM (U1.B13), 08 RAM (D12.F8)
DDR1_D12: 06 CPU_RAM (U1.A12), 08 RAM (D12.E11)
DDR1_D13: 06 CPU_RAM (U1.A13), 08 RAM (D12.E10)
DDR1_D14: 06 CPU_RAM (U1.A14), 08 RAM (D12.E9)
DDR1_D15: 06 CPU_RAM (U1.B14), 08 RAM (D12.D9)
DDR1_D16: 06 CPU_RAM (U1.A19), 08 RAM (D12.T8)
DDR1_D17: 06 CPU_RAM (U1.B19), 08 RAM (D12.T9)
DDR1_D18: 06 CPU_RAM (U1.A20), 08 RAM (D12.T10)
DDR1_D19: 06 CPU_RAM (U1.B20), 08 RAM (D12.T11)
DDR1_D20: 06 CPU_RAM (U1.A21), 08 RAM (D12.R8)
DDR1_D21: 06 CPU_RAM (U1.B21), 08 RAM (D12.R9)
DDR1_D22: 06 CPU_RAM (U1.B22), 08 RAM (D12.R10)
DDR1_D23: 06 CPU_RAM (U1.A22), 08 RAM (D12.R11)
DDR1_D24: 06 CPU_RAM (U1.A23), 08 RAM (D12.C11)
DDR1_D25: 06 CPU_RAM (U1.B23), 08 RAM (D12.C10)
DDR1_D26: 06 CPU_RAM (U1.A24), 08 RAM (D12.C9)
DDR1_D27: 06 CPU_RAM (U1.A25), 08 RAM (D12.C8)
DDR1_D28: 06 CPU_RAM (U1.B24), 08 RAM (D12.B11)
DDR1_D29: 06 CPU_RAM (U1.A26), 08 RAM (D12.B10)
DDR1_D30: 06 CPU_RAM (U1.B25), 08 RAM (D12.B9)
DDR1_D31: 06 CPU_RAM (U1.B26), 08 RAM (D12.B8)
DDR1_DM0: 06 CPU_RAM (U1.E17), 08 RAM (D12.L8)
DDR1_DM1: 06 CPU_RAM (U1.E14), 08 RAM (D12.G8)
DDR1_DM2: 06 CPU_RAM (U1.E20), 08 RAM (D12.P8)
DDR1_DM3: 06 CPU_RAM (U1.E23), 08 RAM (D12.D8)
DDR1_DQS0_N: 06 CPU_RAM (U1.D17), 08 RAM (D12.L11)
DDR1_DQS0_P: 06 CPU_RAM (U1.D18), 08 RAM (D12.L10)
DDR1_DQS1_N: 06 CPU_RAM (U1.D14), 08 RAM (D12.G11)
DDR1_DQS1_P: 06 CPU_RAM (U1.D15), 08 RAM (D12.G10)
DDR1_DQS2_N: 06 CPU_RAM (U1.D20), 08 RAM (D12.P11)
DDR1_DQS2_P: 06 CPU_RAM (U1.D21), 08 RAM (D12.P10)
DDR1_DQS3_N: 06 CPU_RAM (U1.D23), 08 RAM (D12.D11)
DDR1_DQS3_P: 06 CPU_RAM (U1.D24), 08 RAM (D12.D10)
DDR1_ODT0: 06 CPU_RAM (U1.D11), 08 RAM (D12.J8)
DIY_LED: 13 CPU_1 (U1.P24), 19 RADIATOR (R232.2)
EAR_CTL: 13 CPU_1 (U1.N24), 18 I2S (R198.2 R201.1)
EDP_HPD: 14 CPU_2 (U1.M29), 17 EDP (J10.22)
EDP_VCC_EN: 13 CPU_1 (U1.F29), 17 EDP (R189.1)
EFUSE_VQPS_EN_H: 04 POWER (R40.2), 14 CPU_2 (U1.AK3)
FAN_CTL: 14 CPU_2 (U1.T31), 19 RADIATOR (R226.2)
GND: 01 INPUT_PWR (45 pins), 02 INPUT_PWR_2 (27 pins), 03 RK808 (65 pins), 04 POWER (65 pins), 05 CPU_PWR (284 pins), 06 CPU_RAM (26 pins), 07 RAM_PWR (149 pins), 08 RAM (6 pins), 09 EMMC (22 pins), 10 SDMMC (15 pins), 11 USB_2 (17 pins), 12 USB_3 (57 pins), 13 CPU_1 (16 pins), 14 CPU_2 (5 pins), 15 ETHERNET (37 pins), 16 HDMI (32 pins), 17 EDP (30 pins), 18 I2S (47 pins), 19 RADIATOR (14 pins), 20 WiFi_BT (23 pins), 21 CAN (25 pins), 22 PCIE (25 pins), 23 Unused (C34.2 C35.2 C36.2)
GPIO1_A4: 14 CPU_2 (U1.R28), 21 CAN (R280.2)
GPIO1_C1: 14 CPU_2 (U1.M27), 21 CAN (R284.2)
GPIO1_C7: 14 CPU_2 (U1.M31), 21 CAN (R291.2 VD38.6)
GPIO2_A0/I2C2_SDA: 13 CPU_1 (R111.2 U1.G31), 21 CAN (R290.1 VD38.3)
GPIO2_A1/I2C2_SCL: 13 CPU_1 (R112.2 U1.H25), 21 CAN (R293.1 VD38.1)
GPIO2_A3: 13 CPU_1 (U1.F28), 21 CAN (R274.2)
GPIO2_A4: 13 CPU_1 (U1.H29), 21 CAN (R276.2)
GPIO3_D2: 18 I2S (U1.AJ2), 21 CAN (R262.1)
GPIO04_C6/PWM_1: 14 CPU_2 (U1.AL3), 21 CAN (R285.2 VD37.4)
GPU_SLEEP_H: 04 POWER (D5.A1 R36.2), 14 CPU_2 (U1.M25)
HDMI_CEC: 14 CPU_2 (U1.AD7), 16 HDMI (D21.16 R181.1)
HP_DET: 13 CPU_1 (U1.H27), 18 I2S (C379.1 J11.7 R199.1)
I2C0_SCL_PMIC: 03 RK808 (D4.19), 04 POWER (D5.A3 D6.A3 D9.6), 14 CPU_2 (R116.2 U1.N30)
I2C0_SDA_PMIC: 03 RK808 (D4.18), 04 POWER (D5.B1 D6.B1 D9.5), 14 CPU_2 (R115.2 U1.M26)
I2C3_SCL_HDMI: 14 CPU_2 (U1.AL2), 16 HDMI (D21.17 R182.1)
I2C3_SDA_HDMI: 14 CPU_2 (U1.AG6), 16 HDMI (D21.18 R183.1)
I2C4_SCL: 14 CPU_2 (R118.2 U1.P30), 21 CAN (R288.1 VD38.4)
I2C4_SDA: 14 CPU_2 (R117.2 U1.P31), 21 CAN (R289.2 VD37.1)
I2C7_SCL: 12 USB_3 (D17.6), 13 CPU_1 (R114.2 U1.H28)
I2C7_SDA: 12 USB_3 (D17.7), 13 CPU_1 (R113.2 U1.G30)
LCD_BL_PWM0: 14 CPU_2 (U1.AF5), 17 EDP (J10.28)
LDO5V0_SYS: 01 INPUT_PWR (C27.1 D2.6), 04 POWER (VD9.1), 16 HDMI (8 pins)
LOG_DVS_PWM: 04 POWER (R44.1 R48.2 R49.2), 14 CPU_2 (U1.M28)
OTP_OUT_H: 04 POWER (VD8.1), 14 CPU_2 (U1.P26)
PCIE_CLKREQ: 14 CPU_2 (U1.AE6), 22 PCIE (J23.52)
PCIE_RST: 14 CPU_2 (U1.AK4), 22 PCIE (J23.50)
PCIE_WAKE: 14 CPU_2 (U1.AH3), 22 PCIE (J23.54)
PMIC_INT_L: 03 RK808 (D4.49), 14 CPU_2 (U1.M30)
PMIC_SLEEP_H: 03 RK808 (D4.50), 14 CPU_2 (U1.R30)
POWER_ON: 03 RK808 (C79.2 D4.51 R26.1 R30.1), 04 POWER (VD11.1)
PWR_IN: 01 INPUT_PWR (J1.1 J1.2 J2.1 VD1.1), 02 INPUT_PWR_2 (VD43.1)
PWR_KEY_L: 03 RK808 (VD6.1), 13 CPU_1 (U1.V27)
RECOVER: 13 CPU_1 (U1.AH26), 19 RADIATOR (C411.2 R224.1 R225.1)
RESET_L: 03 RK808 (D4.20 R25.1), 13 CPU_1 (C309.2 U1.T30)
RTC_CLKO_SOC: 03 RK808 (D4.68 R22.2), 13 CPU_1 (R104.2)
RTC_CLKO_WIFI: 03 RK808 (D4.67 R23.2), 20 WiFi_BT (C419.2 R236.1 R256.2)
RTC_INT: 04 POWER (R51.1 VD10.1), 14 CPU_2 (U1.R27)
SDIO0_CLK: 14 CPU_2 (U1.AF7), 20 WiFi_BT (R238.1)
SDIO0_CMD: 14 CPU_2 (U1.AH6), 20 WiFi_BT (R237.1)
SDIO0_D0: 14 CPU_2 (U1.AD8), 20 WiFi_BT (R239.1)
SDIO0_D1: 14 CPU_2 (U1.AK5), 20 WiFi_BT (R240.1)
SDIO0_D2: 14 CPU_2 (U1.AG7), 20 WiFi_BT (R241.1)
SDIO0_D3: 14 CPU_2 (U1.AE8), 20 WiFi_BT (R242.1)
SDMMC0_DET_L: 10 SDMMC (R80.9 R81.16 VD12.5), 13 CPU_1 (U1.V28)
SDMMC0_PWR: 10 SDMMC (R82.2), 14 CPU_2 (U1.AG4)
SOUND_SDL: 14 CPU_2 (U1.AK1), 18 I2S (D23.7 R220.2)
SOUND_SDR: 14 CPU_2 (U1.AH5), 18 I2S (D23.8 R221.2)
SPI1_CLK: 14 CPU_2 (U1.P28), 21 CAN (R294.1 VD41.3)
SPI1_CSN0: 14 CPU_2 (U1.P29), 21 CAN (R295.1 VD41.4)
SPI1_RXD/UART4_RXD: 14 CPU_2 (U1.P27), 21 CAN (J22.2 R292.1 VD41.1)
SPI1_TXD/UART4_TXD: 14 CPU_2 (U1.R31), 21 CAN (J22.1 R296.1 VD41.6)
SPI2_CLK: 13 CPU_1 (U1.H31), 21 CAN (R261.1)
SPI2_RXD: 13 CPU_1 (U1.F30), 21 CAN (R260.1)
SPI2_TXD: 13 CPU_1 (U1.H24), 21 CAN (R259.1)
UART0_CTS: 14 CPU_2 (U1.AG8), 20 WiFi_BT (R251.1)
UART0_RTS: 14 CPU_2 (U1.AL5), 20 WiFi_BT (R254.1)
UART0_RXD: 14 CPU_2 (U1.AE9), 20 WiFi_BT (R252.1)
UART0_TXD: 14 CPU_2 (U1.AH8), 20 WiFi_BT (R253.1)
UART2DBG_RX: 14 CPU_2 (U1.AK2), 19 RADIATOR (R222.1 VD28.1)
UART2DBG_TX: 14 CPU_2 (U1.AJ4), 19 RADIATOR (R223.1 VD29.2)
VCC1V8_DDR: 03 RK808 (C76.1 C77.1 R24.2), 07 RAM_PWR (31 pins)
VCC3V3_S3: 03 RK808 (C57.1 D4.7), 09 EMMC (6 pins), 11 USB_2 (C277.1 U1.Y25), 12 USB_3 (C293.1 C299.1 U1.AB18 U1.AB21), 15 ETHERNET (C344.1 U1.J23)
VCC3V3_SYS: 01 INPUT_PWR (6 pins), 03 RK808 (9 pins), 04 POWER (10 pins), 10 SDMMC (C271.2 C272.1 D14.1), 12 USB_3 (C287.1 D17.4), 17 EDP (C361.1 R187.2 R194.2 VT3.2), 19 RADIATOR (R222.2 VD33.1 VD34.1), 20 WiFi_BT (C417.1 C418.1 L23.1), 21 CAN (16 pins)
VCC5V0_HOST_EN: 11 USB_2 (D15.4), 12 USB_3 (R101.1), 14 CPU_2 (U1.R25)
VCC5V0_SYS: 01 INPUT_PWR (12 pins), 03 RK808 (21 pins), 04 POWER (17 pins), 11 USB_2 (C273.2 D15.5), 12 USB_3 (9 pins), 17 EDP (R193.2), 18 I2S (9 pins), 21 CAN (J20.13)
VCC5V0_TYPEC0_EN: 12 USB_3 (D16.4), 14 CPU_2 (U1.M24)
VCC12V_SYS: 01 INPUT_PWR (16 pins), 17 EDP (R192.2), 19 RADIATOR (C409.2 C410.2 L20.2), 21 CAN (J20.14)
VCC_1V5: 03 RK808 (C49.1 D4.2 R16.2), 13 CPU_1 (C317.1 U1.J24), 14 CPU_2 (C319.1 C321.1 U1.AC8 U1.N23)
VCC_1V8: 03 RK808 (13 pins), 04 POWER (R34.2 R37.2 R42.2 R48.1), 09 EMMC (11 pins), 14 CPU_2 (C323.1 U1.AB8), 15 ETHERNET (C345.1 U1.J22), 17 EDP (C373.1 U1.J19 U1.J20), 20 WiFi_BT (R243.2), 23 Unused (6 pins)
VCC_3V0: 03 RK808 (C55.1 C71.2 D4.15 D4.17), 04 POWER (R49.1), 13 CPU_1 (6 pins), 14 CPU_2 (8 pins), 16 HDMI (6 pins), 18 I2S (R199.2), 21 CAN (R269.2 R270.2 R277.2 R281.2)
VCC_DDR: 03 RK808 (7 pins), 06 CPU_RAM (46 pins), 07 RAM_PWR (122 pins)
VCC_EFUSE: 04 POWER (C103.1 C104.1 C105.1 D7.5), 13 CPU_1 (U1.AD23)
VCC_LAN: 03 RK808 (C59.1 D4.11), 15 ETHERNET (16 pins)
VCC_SDIO: 03 RK808 (C44.1 D4.12), 10 SDMMC (10 pins)
VCCA0V9_HDMI: 03 RK808 (C43.1 D4.5), 16 HDMI (C350.1 C351.1 U1.AA16 U1.AA17)
VCCA1V8_CODEC: 03 RK808 (C38.1 D4.31), 18 I2S (10 pins)
VCCA1V8_HDMI: 03 RK808 (C40.1 D4.33), 16 HDMI (C352.1 C353.1 U1.AD16)
VCCA3V0_CODEC: 03 RK808 (C47.1 D4.14), 18 I2S (5 pins)
VCCA_0V9: 04 POWER (5 pins), 06 CPU_RAM (C197.1 C200.1 U1.H14 U1.R8), 09 EMMC (C259.1 U1.L24), 11 USB_2 (C279.1 U1.V24), 12 USB_3 (7 pins), 13 CPU_1 (C310.1 C311.1 U1.R17 U1.T24), 17 EDP (C372.1 U1.H20), 22 PCIE (C440.1 U1.W24)
VCCA_1V8: 03 RK808 (C41.1 D4.3), 04 POWER (R51.2), 11 USB_2 (C278.1 U1.U24), 12 USB_3 (C294.1 C298.1 U1.AA18 U1.AA21), 13 CPU_1 (9 pins), 19 RADIATOR (R224.2), 22 PCIE (C441.1 U1.Y24)
VDD_CENTER: 03 RK808 (C52.2 C53.2 L5.2 R15.1), 05 CPU_PWR (19 pins)
VDD_CPU_B: 04 POWER (7 pins), 05 CPU_PWR (24 pins)
VDD_CPU_B_FB: 04 POWER (D6.A4 R38.1), 05 CPU_PWR (U1.N18)
VDD_CPU_L: 03 RK808 (C62.2 C63.2 L7.2 R18.1), 05 CPU_PWR (16 pins)
VDD_GPU: 04 POWER (7 pins), 05 CPU_PWR (34 pins)
VDD_GPU_FB: 04 POWER (D5.A4 R35.1), 05 CPU_PWR (U1.T15)
VDD_LOG: 04 POWER (7 pins), 05 CPU_PWR (21 pins)
VPP_OTP: 03 RK808 (C78.2 D4.6 R29.2), 04 POWER (VT1.3)
WIFI_HOST_WAKE_L: 13 CPU_1 (U1.V31), 20 WiFi_BT (R235.1)
WIFI_REG_ON_H: 13 CPU_1 (U1.W31), 20 WiFi_BT (R234.1)
WORK_LED: 14 CPU_2 (U1.AD9), 19 RADIATOR (R229.2)